# EAGLE design MM24I (EAGLE 9.5.2)

## Sheet 1 of 3
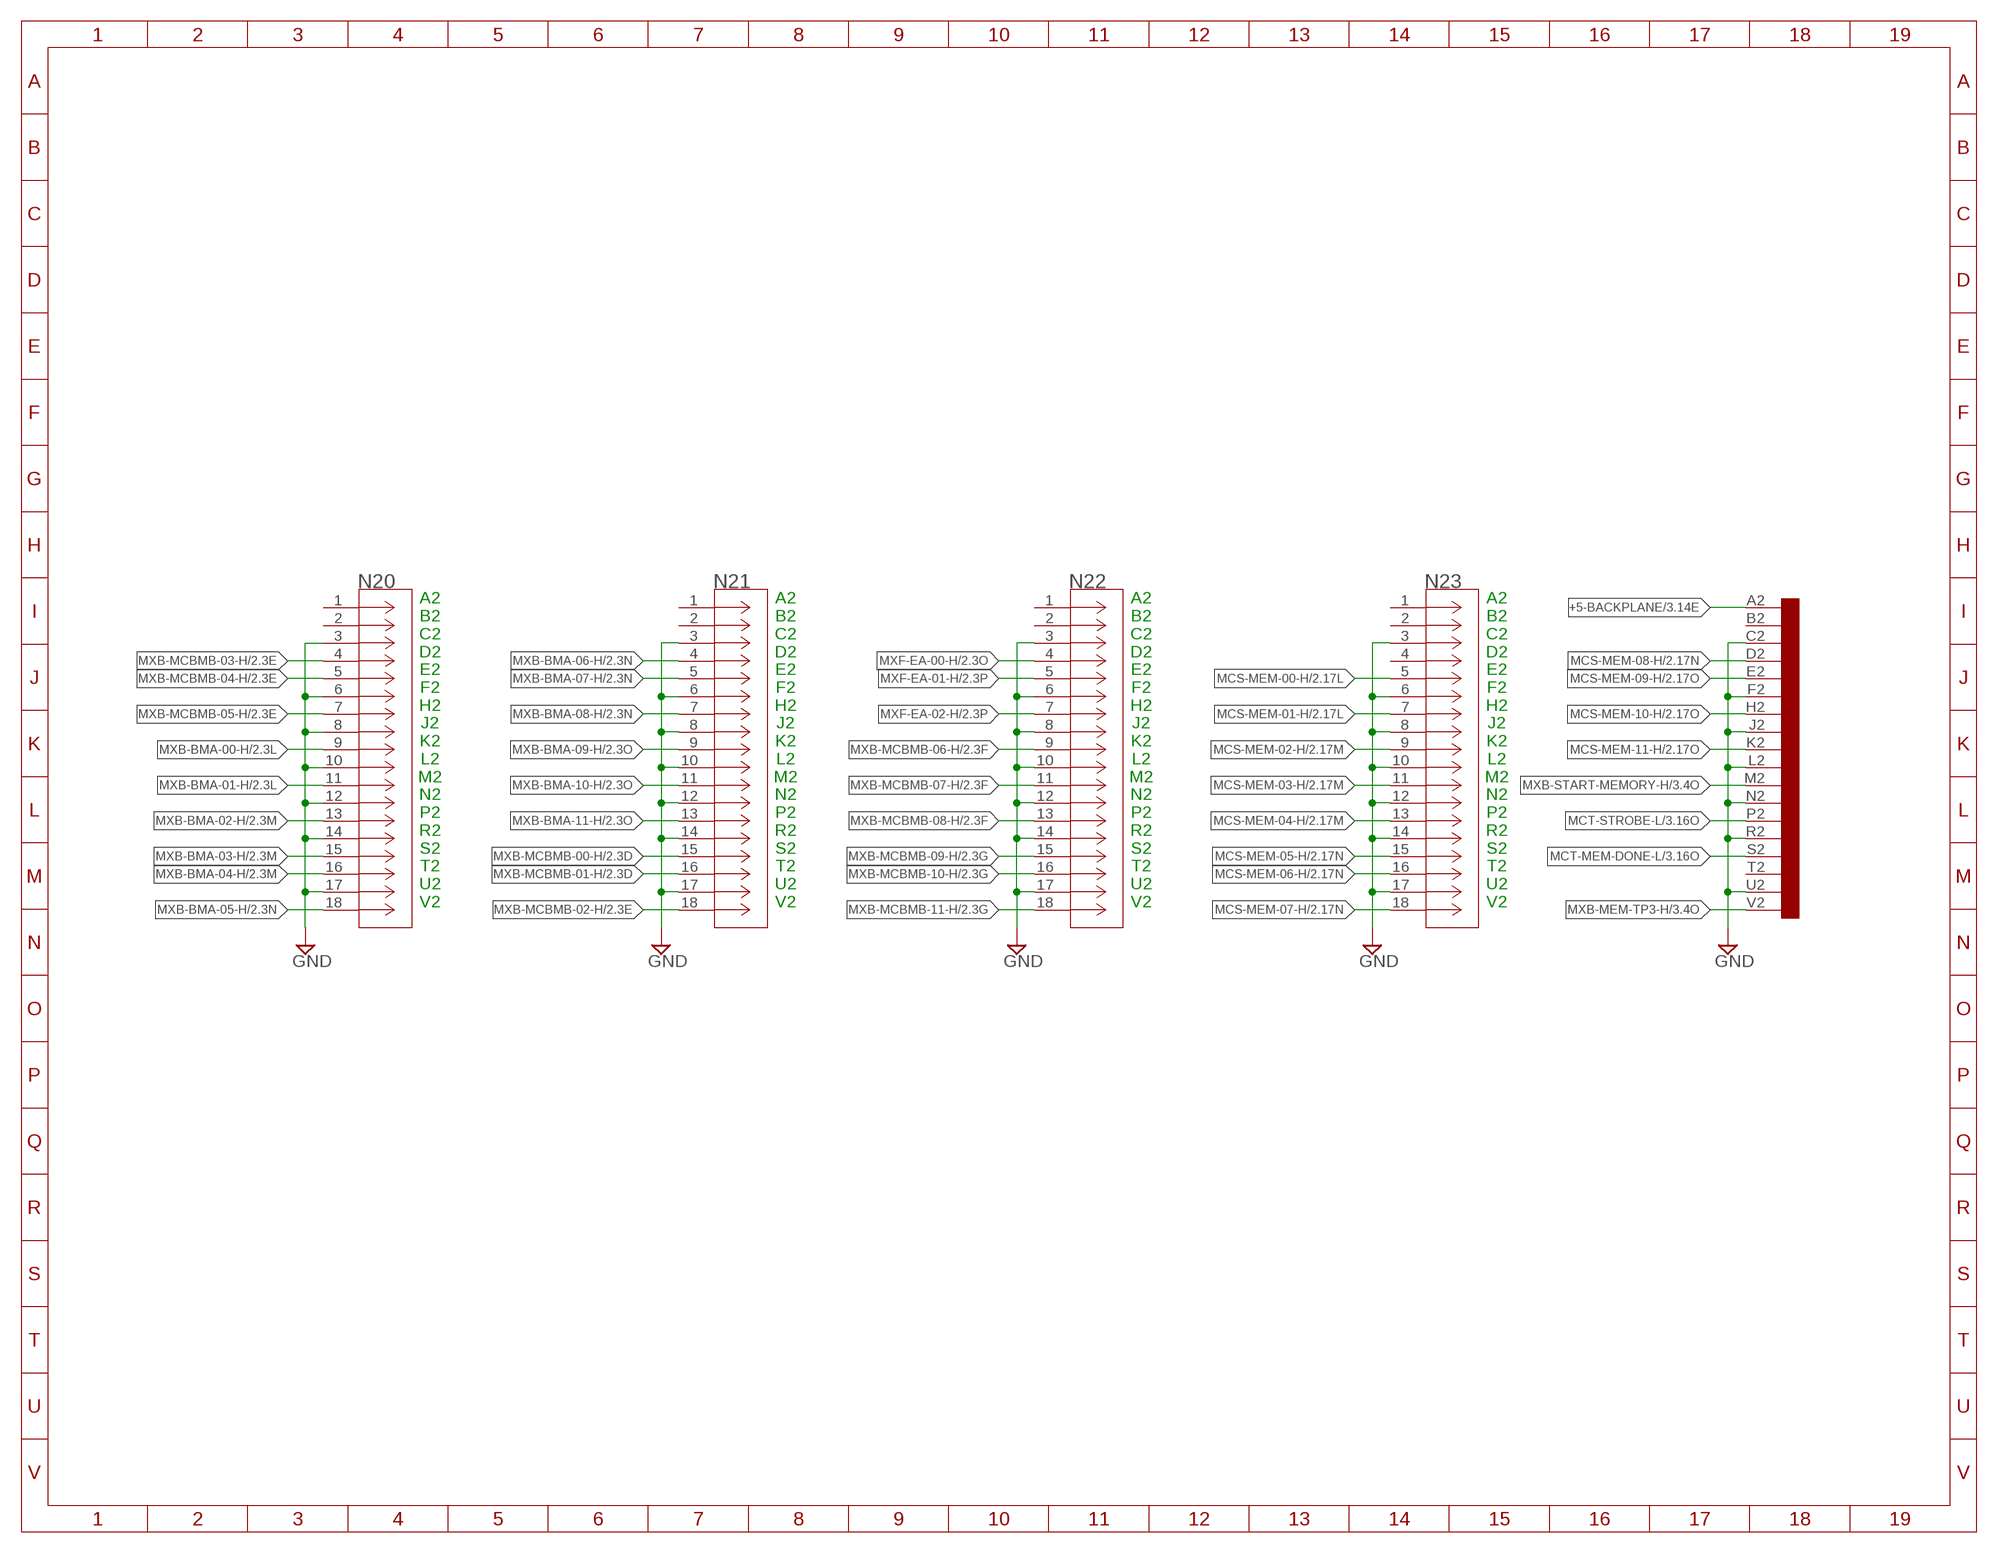
[diagram p0: schematic, sheet 1]

### Parts
N20  FH12-18S-0.5SV(55)  [CON18_1X18_DUTB_HRS]
N21  FH12-18S-0.5SV(55)  [CON18_1X18_DUTB_HRS]
N22  FH12-18S-0.5SV(55)  [CON18_1X18_DUTB_HRS]
N23  FH12-18S-0.5SV(55)  [CON18_1X18_DUTB_HRS]
U$1  SINGLE  [EDGE-CON2]

### Nets
+5-BACKPLANE [power]: U$1.A2 ; also sheet 3
GND [power]: N20.3 N20.6 N20.8 N20.10 N20.12 N20.14 N20.17 N21.3 N21.6 N21.8 N21.10 N21.12 N21.14 N21.17 N22.3 N22.6 N22.8 N22.10 N22.12 N22.14 N22.17 N23.3 N23.6 N23.8 N23.10 N23.12 N23.14 N23.17 U$1.C2 U$1.F2 U$1.J2 U$1.L2 U$1.N2 U$1.R2 U$1.U2 ; also sheet 2,3
MCS-MEM-00-H: N23.5 ; also sheet 2
MCS-MEM-01-H: N23.7 ; also sheet 2
MCS-MEM-02-H: N23.9 ; also sheet 2
MCS-MEM-03-H: N23.11 ; also sheet 2
MCS-MEM-04-H: N23.13 ; also sheet 2
MCS-MEM-05-H: N23.15 ; also sheet 2
MCS-MEM-06-H: N23.16 ; also sheet 2
MCS-MEM-07-H: N23.18 ; also sheet 2
MCS-MEM-08-H: U$1.D2 ; also sheet 2
MCS-MEM-09-H: U$1.E2 ; also sheet 2
MCS-MEM-10-H: U$1.H2 ; also sheet 2
MCS-MEM-11-H: U$1.K2 ; also sheet 2
MCT-MEM-DONE-L: U$1.S2 ; also sheet 3
MCT-STROBE-L: U$1.P2 ; also sheet 3
MXB-BMA-00-H: N20.9 ; also sheet 2
MXB-BMA-01-H: N20.11 ; also sheet 2
MXB-BMA-02-H: N20.13 ; also sheet 2
MXB-BMA-03-H: N20.15 ; also sheet 2
MXB-BMA-04-H: N20.16 ; also sheet 2
MXB-BMA-05-H: N20.18 ; also sheet 2
MXB-BMA-06-H: N21.4 ; also sheet 2
MXB-BMA-07-H: N21.5 ; also sheet 2
MXB-BMA-08-H: N21.7 ; also sheet 2
MXB-BMA-09-H: N21.9 ; also sheet 2
MXB-BMA-10-H: N21.11 ; also sheet 2
MXB-BMA-11-H: N21.13 ; also sheet 2
MXB-MCBMB-00-H: N21.15 ; also sheet 2
MXB-MCBMB-01-H: N21.16 ; also sheet 2
MXB-MCBMB-02-H: N21.18 ; also sheet 2
MXB-MCBMB-03-H: N20.4 ; also sheet 2
MXB-MCBMB-04-H: N20.5 ; also sheet 2
MXB-MCBMB-05-H: N20.7 ; also sheet 2
MXB-MCBMB-06-H: N22.9 ; also sheet 2
MXB-MCBMB-07-H: N22.11 ; also sheet 2
MXB-MCBMB-08-H: N22.13 ; also sheet 2
MXB-MCBMB-09-H: N22.15 ; also sheet 2
MXB-MCBMB-10-H: N22.16 ; also sheet 2
MXB-MCBMB-11-H: N22.18 ; also sheet 2
MXB-MEM-TP3-H: U$1.V2 ; also sheet 3
MXB-START-MEMORY-H: U$1.M2 ; also sheet 3
MXF-EA-00-H: N22.4 ; also sheet 2
MXF-EA-01-H: N22.5 ; also sheet 2
MXF-EA-02-H: N22.7 ; also sheet 2
Unconnected: N20.1 N20.2 N21.1 N21.2 N22.1 N22.2 N23.1 N23.2 N23.4 U$1.A1 U$1.B1 U$1.B2 U$1.C1 U$1.D1 U$1.E1 U$1.F1 U$1.H1 U$1.J1 U$1.K1 U$1.L1 U$1.M1 U$1.N1 U$1.P1 U$1.R1 U$1.S1 U$1.T1 U$1.T2 U$1.U1 U$1.V1

### Notes on the sheet
- A2
  B2
  C2
  D2
  E2
  F2
  H2
  J2
  K2
  L2
  M2
  N2
  P2
  R2
  S2
  T2
  U2
  V2
- A2
  B2
  C2
  D2
  E2
  F2
  H2
  J2
  K2
  L2
  M2
  N2
  P2
  R2
  S2
  T2
  U2
  V2
- A2
  B2
  C2
  D2
  E2
  F2
  H2
  J2
  K2
  L2
  M2
  N2
  P2
  R2
  S2
  T2
  U2
  V2
- A2
  B2
  C2
  D2
  E2
  F2
  H2
  J2
  K2
  L2
  M2
  N2
  P2
  R2
  S2
  T2
  U2
  V2

## Sheet 2 of 3
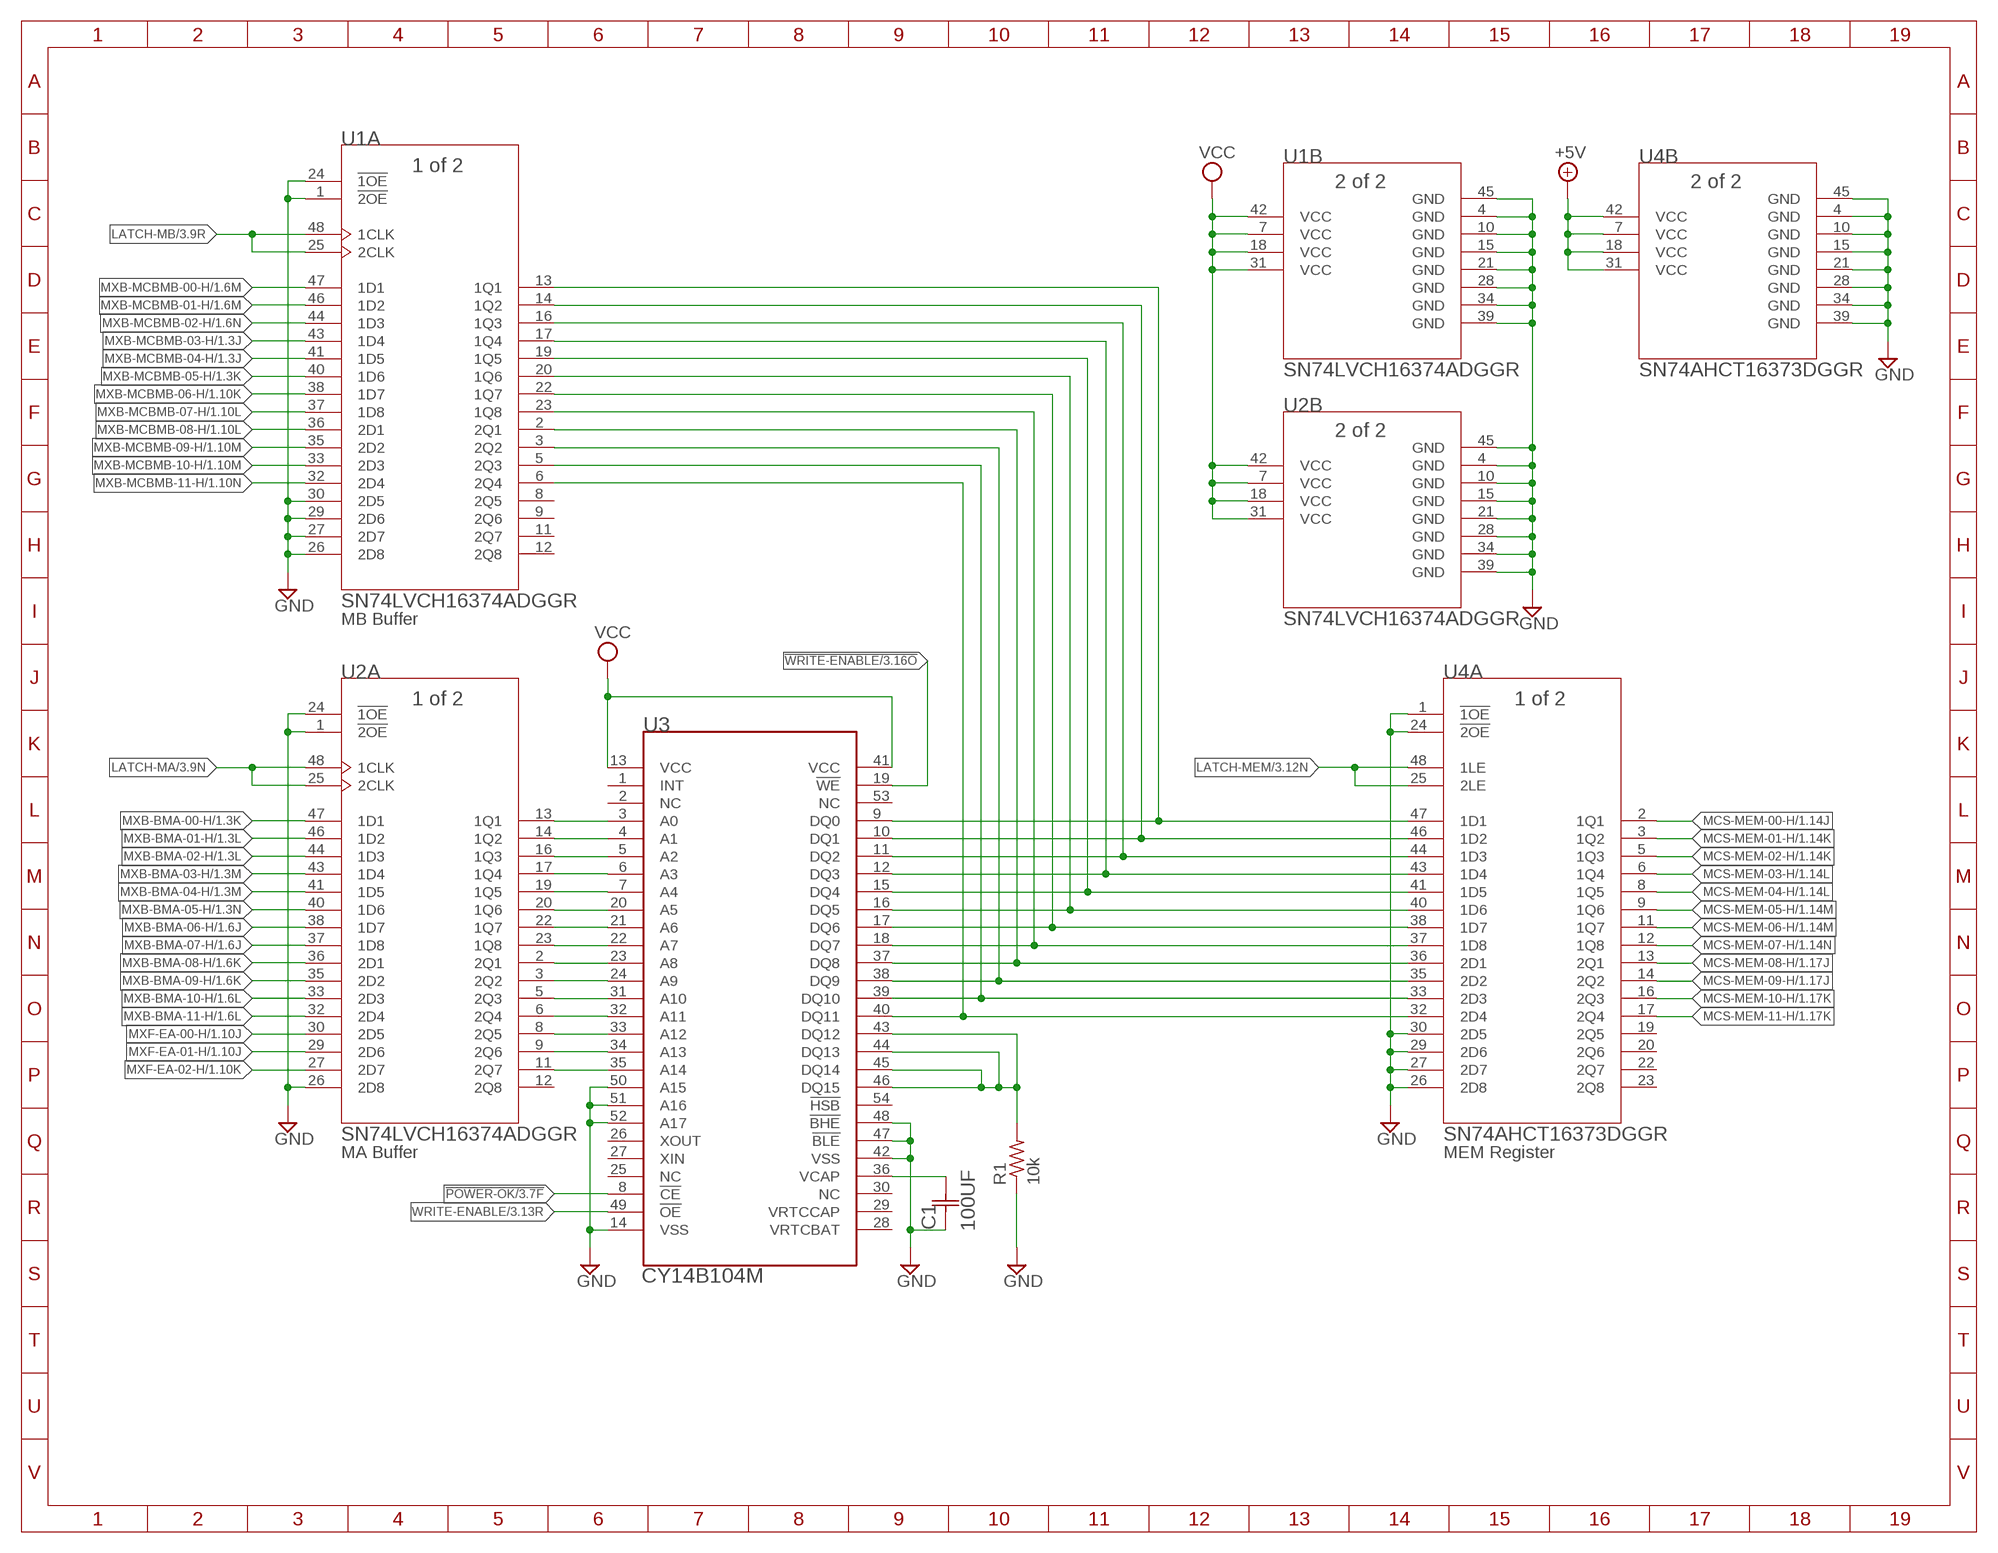
[diagram p1: schematic, sheet 2]

### Parts
C1  100UF  NOJD107M010RWJ  [CAPCP7343X430N]
R1  10k  R-US_R0402  [R0402]
U1  SN74LVCH16374ADGGR  [DGG48]
U2  SN74LVCH16374ADGGR  [DGG48]
U3  CY14B104M  [TSOPII-54]
U4  SN74AHCT16373DGGR  [DGG48]

### Nets
!POWER-OK: U3.8(!CE) ; also sheet 3
!WRITE-ENABLE: U3.19(!WE) ; also sheet 3
+5V [power]: U4.7(B:VCC) U4.18(B:VCC) U4.31(B:VCC) U4.42(B:VCC) ; also sheet 3
GND [power]: C1.2(C2) R1.1 U1.1(A:!2OE) U1.4(B:GND) U1.10(B:GND) U1.15(B:GND) U1.21(B:GND) U1.24(A:!1OE) U1.26(A:2D8) U1.27(A:2D7) U1.28(B:GND) U1.29(A:2D6) U1.30(A:2D5) U1.34(B:GND) U1.39(B:GND) U1.45(B:GND) U2.1(A:!2OE) U2.4(B:GND) U2.10(B:GND) U2.15(B:GND) U2.21(B:GND) U2.24(A:!1OE) U2.26(A:2D8) U2.28(B:GND) U2.34(B:GND) U2.39(B:GND) U2.45(B:GND) U3.14(VSS) U3.42(VSS) U3.47(!BLE) U3.48(!BHE) U3.50(A15) U3.51(A16) U3.52(A17) U4.1(A:!1OE) U4.4(B:GND) U4.10(B:GND) U4.15(B:GND) U4.21(B:GND) U4.24(A:!2OE) U4.26(A:2D8) U4.27(A:2D7) U4.28(B:GND) U4.29(A:2D6) U4.30(A:2D5) U4.34(B:GND) U4.39(B:GND) U4.45(B:GND) ; also sheet 1,3
LATCH-MA: U2.25(A:2CLK) U2.48(A:1CLK) ; also sheet 3
LATCH-MB: U1.25(A:2CLK) U1.48(A:1CLK) ; also sheet 3
LATCH-MEM: U4.25(A:2LE) U4.48(A:1LE) ; also sheet 3
MCS-MEM-00-H: U4.2(A:1Q1) ; also sheet 1
MCS-MEM-01-H: U4.3(A:1Q2) ; also sheet 1
MCS-MEM-02-H: U4.5(A:1Q3) ; also sheet 1
MCS-MEM-03-H: U4.6(A:1Q4) ; also sheet 1
MCS-MEM-04-H: U4.8(A:1Q5) ; also sheet 1
MCS-MEM-05-H: U4.9(A:1Q6) ; also sheet 1
MCS-MEM-06-H: U4.11(A:1Q7) ; also sheet 1
MCS-MEM-07-H: U4.12(A:1Q8) ; also sheet 1
MCS-MEM-08-H: U4.13(A:2Q1) ; also sheet 1
MCS-MEM-09-H: U4.14(A:2Q2) ; also sheet 1
MCS-MEM-10-H: U4.16(A:2Q3) ; also sheet 1
MCS-MEM-11-H: U4.17(A:2Q4) ; also sheet 1
MXB-BMA-00-H: U2.47(A:1D1) ; also sheet 1
MXB-BMA-01-H: U2.46(A:1D2) ; also sheet 1
MXB-BMA-02-H: U2.44(A:1D3) ; also sheet 1
MXB-BMA-03-H: U2.43(A:1D4) ; also sheet 1
MXB-BMA-04-H: U2.41(A:1D5) ; also sheet 1
MXB-BMA-05-H: U2.40(A:1D6) ; also sheet 1
MXB-BMA-06-H: U2.38(A:1D7) ; also sheet 1
MXB-BMA-07-H: U2.37(A:1D8) ; also sheet 1
MXB-BMA-08-H: U2.36(A:2D1) ; also sheet 1
MXB-BMA-09-H: U2.35(A:2D2) ; also sheet 1
MXB-BMA-10-H: U2.33(A:2D3) ; also sheet 1
MXB-BMA-11-H: U2.32(A:2D4) ; also sheet 1
MXB-MCBMB-00-H: U1.47(A:1D1) ; also sheet 1
MXB-MCBMB-01-H: U1.46(A:1D2) ; also sheet 1
MXB-MCBMB-02-H: U1.44(A:1D3) ; also sheet 1
MXB-MCBMB-03-H: U1.43(A:1D4) ; also sheet 1
MXB-MCBMB-04-H: U1.41(A:1D5) ; also sheet 1
MXB-MCBMB-05-H: U1.40(A:1D6) ; also sheet 1
MXB-MCBMB-06-H: U1.38(A:1D7) ; also sheet 1
MXB-MCBMB-07-H: U1.37(A:1D8) ; also sheet 1
MXB-MCBMB-08-H: U1.36(A:2D1) ; also sheet 1
MXB-MCBMB-09-H: U1.35(A:2D2) ; also sheet 1
MXB-MCBMB-10-H: U1.33(A:2D3) ; also sheet 1
MXB-MCBMB-11-H: U1.32(A:2D4) ; also sheet 1
MXF-EA-00-H: U2.30(A:2D5) ; also sheet 1
MXF-EA-01-H: U2.29(A:2D6) ; also sheet 1
MXF-EA-02-H: U2.27(A:2D7) ; also sheet 1
N$2: U1.13(A:1Q1) U3.9(DQ0) U4.47(A:1D1)
N$3: U1.14(A:1Q2) U3.10(DQ1) U4.46(A:1D2)
N$4: U1.16(A:1Q3) U3.11(DQ2) U4.44(A:1D3)
N$5: U1.17(A:1Q4) U3.12(DQ3) U4.43(A:1D4)
N$6: U1.19(A:1Q5) U3.15(DQ4) U4.41(A:1D5)
N$7: U1.20(A:1Q6) U3.16(DQ5) U4.40(A:1D6)
N$9: R1.2 U3.43(DQ12) U3.44(DQ13) U3.45(DQ14) U3.46(DQ15)
N$11: U1.22(A:1Q7) U3.17(DQ6) U4.38(A:1D7)
N$13: U1.23(A:1Q8) U3.18(DQ7) U4.37(A:1D8)
N$14: U1.2(A:2Q1) U3.37(DQ8) U4.36(A:2D1)
N$15: U1.3(A:2Q2) U3.38(DQ9) U4.35(A:2D2)
N$16: U1.5(A:2Q3) U3.39(DQ10) U4.33(A:2D3)
N$17: U1.6(A:2Q4) U3.40(DQ11) U4.32(A:2D4)
N$30: U2.2(A:2Q1) U3.23(A8)
N$31: U2.16(A:1Q3) U3.5(A2)
N$32: U2.13(A:1Q1) U3.3(A0)
N$33: U2.14(A:1Q2) U3.4(A1)
N$34: U2.17(A:1Q4) U3.6(A3)
N$36: U2.19(A:1Q5) U3.7(A4)
N$37: U2.20(A:1Q6) U3.20(A5)
N$38: U2.22(A:1Q7) U3.21(A6)
N$39: U2.23(A:1Q8) U3.22(A7)
N$40: U2.3(A:2Q2) U3.24(A9)
N$41: U2.5(A:2Q3) U3.31(A10)
N$42: U2.6(A:2Q4) U3.32(A11)
N$43: U2.8(A:2Q5) U3.33(A12)
N$44: U2.9(A:2Q6) U3.34(A13)
N$45: U2.11(A:2Q7) U3.35(A14)
VCAP [power]: C1.1(C1) U3.36(VCAP)
VCC [power]: U1.7(B:VCC) U1.18(B:VCC) U1.31(B:VCC) U1.42(B:VCC) U2.7(B:VCC) U2.18(B:VCC) U2.31(B:VCC) U2.42(B:VCC) U3.13(VCC) U3.41(VCC) ; also sheet 3
WRITE-ENABLE: U3.49(!OE) ; also sheet 3
Unconnected: U1.8(A:2Q5) U1.9(A:2Q6) U1.11(A:2Q7) U1.12(A:2Q8) U2.12(A:2Q8) U3.1(INT) U3.2(NC) U3.25(NC) U3.26(XOUT) U3.27(XIN) U3.28(VRTCBAT) U3.29(VRTCCAP) U3.30(NC) U3.53(NC) U3.54(!HSB) U4.19(A:2Q5) U4.20(A:2Q6) U4.22(A:2Q7) U4.23(A:2Q8)

### Notes on the sheet
- MB Buffer
- MA Buffer | MEM Register

## Sheet 3 of 3
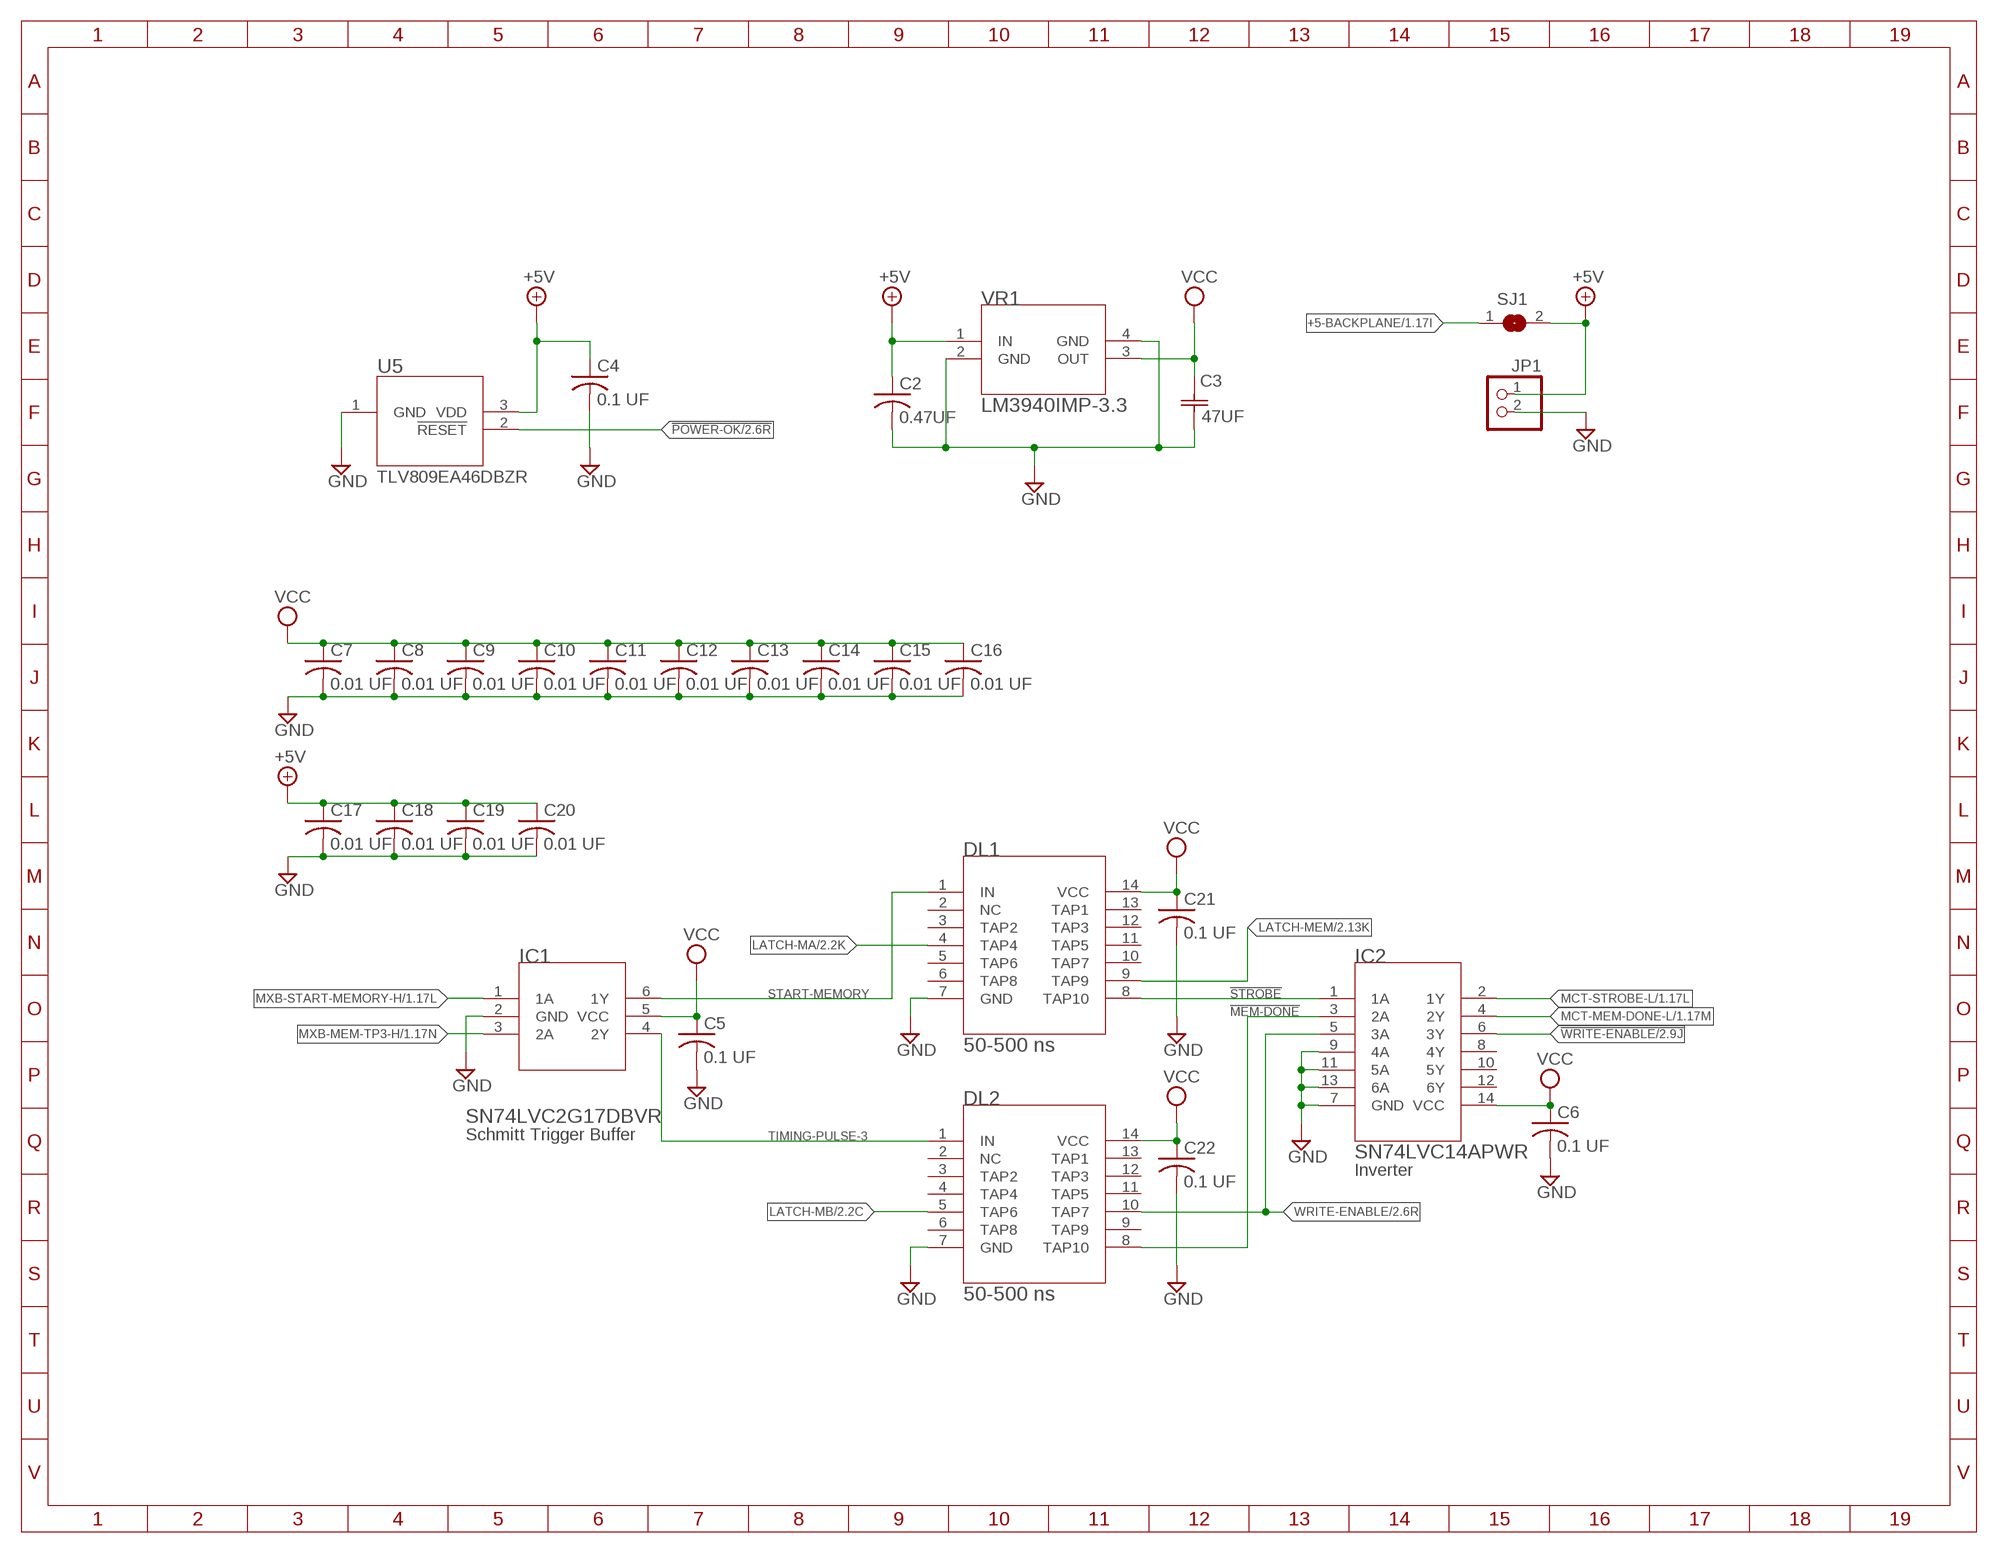
[diagram p2: schematic, sheet 3]

### Parts
C2  0.47UF  C-USC0805  [C0805]
C3  47UF  NOJC476M010RWJ  [NOJC]
C4  0.1 UF  C-USC0402  [C0402]
C5  0.1 UF  C-USC0402  [C0402]
C6  0.1 UF  C-USC0402  [C0402]
C7  0.01 UF  C-USC0402  [C0402]
C8  0.01 UF  C-USC0402  [C0402]
C9  0.01 UF  C-USC0402  [C0402]
C10  0.01 UF  C-USC0402  [C0402]
C11  0.01 UF  C-USC0402  [C0402]
C12  0.01 UF  C-USC0402  [C0402]
C13  0.01 UF  C-USC0402  [C0402]
C14  0.01 UF  C-USC0402  [C0402]
C15  0.01 UF  C-USC0402  [C0402]
C16  0.01 UF  C-USC0402  [C0402]
C17  0.01 UF  C-USC0402  [C0402]
C18  0.01 UF  C-USC0402  [C0402]
C19  0.01 UF  C-USC0402  [C0402]
C20  0.01 UF  C-USC0402  [C0402]
C21  0.1 UF  C-USC0402  [C0402]
C22  0.1 UF  C-USC0402  [C0402]
DL1  50-500 ns  DS1110LE-500+  [21-0066J_14]
DL2  50-500 ns  DS1110LE-500+  [21-0066J_14]
IC1  SN74LVC2G17DBVR  [DBV6]
IC2  SN74LVC14APWR  [PW14]
JP1  PINHD-1X2  [1X02]
SJ1  SJ  [SJ]
U5  TLV809EA46DBZR  [DBZ3]
VR1  LM3940IMP-3.3  [MP04A]

### Nets
!MEM-DONE: DL2.8(TAP10) IC2.3(2A)
!POWER-OK: U5.2(!RESET) ; also sheet 2
!STROBE: DL1.8(TAP10) IC2.1(1A)
!WRITE-ENABLE: IC2.6(3Y) ; also sheet 2
+5-BACKPLANE [power]: SJ1.1 ; also sheet 1
+5V [power]: C2.1 C4.1 C17.1 C18.1 C19.1 C20.1 JP1.1 SJ1.2 U5.3(VDD) VR1.1(IN) ; also sheet 2
GND [power]: C2.2 C3.2(C2) C4.2 C5.2 C6.2 C7.2 C8.2 C9.2 C10.2 C11.2 C12.2 C13.2 C14.2 C15.2 C16.2 C17.2 C18.2 C19.2 C20.2 C21.2 C22.2 DL1.7(GND) DL2.7(GND) IC1.2(GND) IC2.7(GND) IC2.9(4A) IC2.11(5A) IC2.13(6A) JP1.2 U5.1(GND) VR1.2(GND) VR1.4(GND) ; also sheet 1,2
LATCH-MA: DL1.4(TAP4) ; also sheet 2
LATCH-MB: DL2.5(TAP6) ; also sheet 2
LATCH-MEM: DL1.9(TAP9) ; also sheet 2
MCT-MEM-DONE-L: IC2.4(2Y) ; also sheet 1
MCT-STROBE-L: IC2.2(1Y) ; also sheet 1
MXB-MEM-TP3-H: IC1.3(2A) ; also sheet 1
MXB-START-MEMORY-H: IC1.1(1A) ; also sheet 1
START-MEMORY: DL1.1(IN) IC1.6(1Y)
TIMING-PULSE-3: DL2.1(IN) IC1.4(2Y)
VCC [power]: C3.1(C1) C5.1 C6.1 C7.1 C8.1 C9.1 C10.1 C11.1 C12.1 C13.1 C14.1 C15.1 C16.1 C21.1 C22.1 DL1.14(VCC) DL2.14(VCC) IC1.5(VCC) IC2.14(VCC) VR1.3(OUT) ; also sheet 2
WRITE-ENABLE: DL2.10(TAP7) IC2.5(3A) ; also sheet 2
Unconnected: DL1.2(NC) DL1.3(TAP2) DL1.5(TAP6) DL1.6(TAP8) DL1.10(TAP7) DL1.11(TAP5) DL1.12(TAP3) DL1.13(TAP1) DL2.2(NC) DL2.3(TAP2) DL2.4(TAP4) DL2.6(TAP8) DL2.9(TAP9) DL2.11(TAP5) DL2.12(TAP3) DL2.13(TAP1) IC2.8(4Y) IC2.10(5Y) IC2.12(6Y)

### Notes on the sheet
- Schmitt Trigger Buffer
- Inverter

## Library data of the parts
C1 = MM24I:NOJD107M010RWJ: CAP NIOB OXIDE , 2917; CAPACITANCETOLERANCE: ±20%; MPN: NOJD107M010RWJ; SUPPLIER: AVX; VOLTAGERATING: 10V
C2 C4-C22 = rcl:C-US: CAPACITOR, American symbol; SPICEPREFIX: C
C3 = MM24I:NOJC476M010RWJ: CAP, NIOB OXIDE, 2312; BUILT_BY: EMA_UL_Team; MANUFACTURER_PART_NUMBER: NOJC476M010RWJ; VENDOR: AVX Corporation
DL1 DL2 = MM24I:DS1110LE-500+; BUILT_BY: EMA_UL_Team; MANUFACTURER_PART_NUMBER: DS1110LE-100+; VENDOR: Maxim Integrated Products
IC1 = MM24I:SN74LVC2G17DBVR; BUILT_BY: EMA_UL_Team; MANUFACTURER: Texas Instruments; MANUFACTURER_PART_NUMBER: SN74LVC2G17DBVR; VENDOR: Texas Instruments
IC2 = MM24I:SN74LVC14APWR; BUILT_BY: EMA_UL_Team; MANUFACTURER: Texas Instruments; MANUFACTURER_PART_NUMBER: SN74LVC14APWR; VENDOR: Texas Instruments
JP1 = pinhead:PINHD-1X2: PIN HEADER
N20-N23 = MM24I:FH12-18S-0.5SV(55); BUILT_BY: EMA_UL_Team; MANUFACTURER_PART_NUMBER: FH12-18S-0.5SV(55); VENDOR: Hirose
R1 = rcl:R-US_: RESISTOR, American symbol; SPICEPREFIX: R
SJ1 = jumper:SJ: SMD solder JUMPER
U1 U2 = MM24I:SN74LVCH16374ADGGR; BUILT_BY: EMA_UL_Team; MANUFACTURER_PART_NUMBER: SN74LVCH16374ADGGR; VENDOR: Texas Instruments
U3 = MM24I:CY14B104M: Cypress CY14B104M 4-Mbit (256 K × 16) nvSRAM with Real Time Clock https://www.cypress.com/file/43036/download
U4 = MM24I:SN74AHCT16373DGGR; BUILT_BY: EMA_UL_Team; MANUFACTURER: Texas Instruments; MANUFACTURER_PART_NUMBER: SN74AHCT16373DGGR; VENDOR: Texas Instruments
U5 = MM24I:TLV809EA46DBZR; DELAY: 200ms; MANUFACTURER: Texas Instruments; MANUFACTURER_PART_NUMBER: TLV809EA46DBZR; THRESHOLD: 4.6V; VENDOR: Texas Instruments
U$1 = dec-con:SINGLE: Single-Height DEC board
VR1 = MM24I:LM3940IMP-3.3; BUILT_BY: EMA_UL_Team; MANUFACTURER_PART_NUMBER: LM3940IMP-3.3/NOPB; VENDOR: Texas Instruments

## Net classes
0 default: width 0.15 mm, drill 0.2 mm
1 power: width 0.3 mm, drill 0.3 mm

## Board
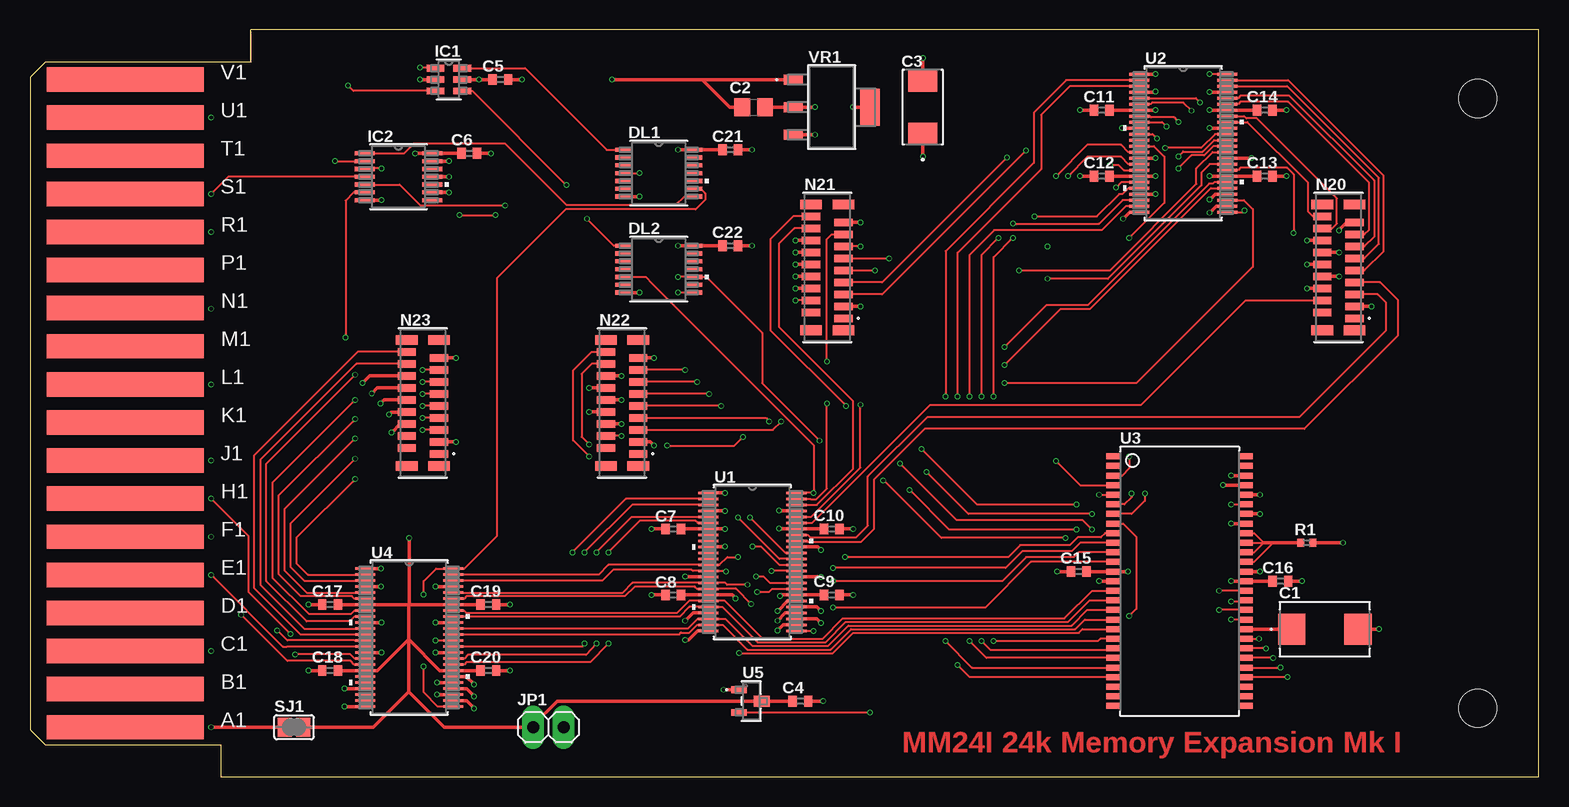
[diagram p3: board, top side]
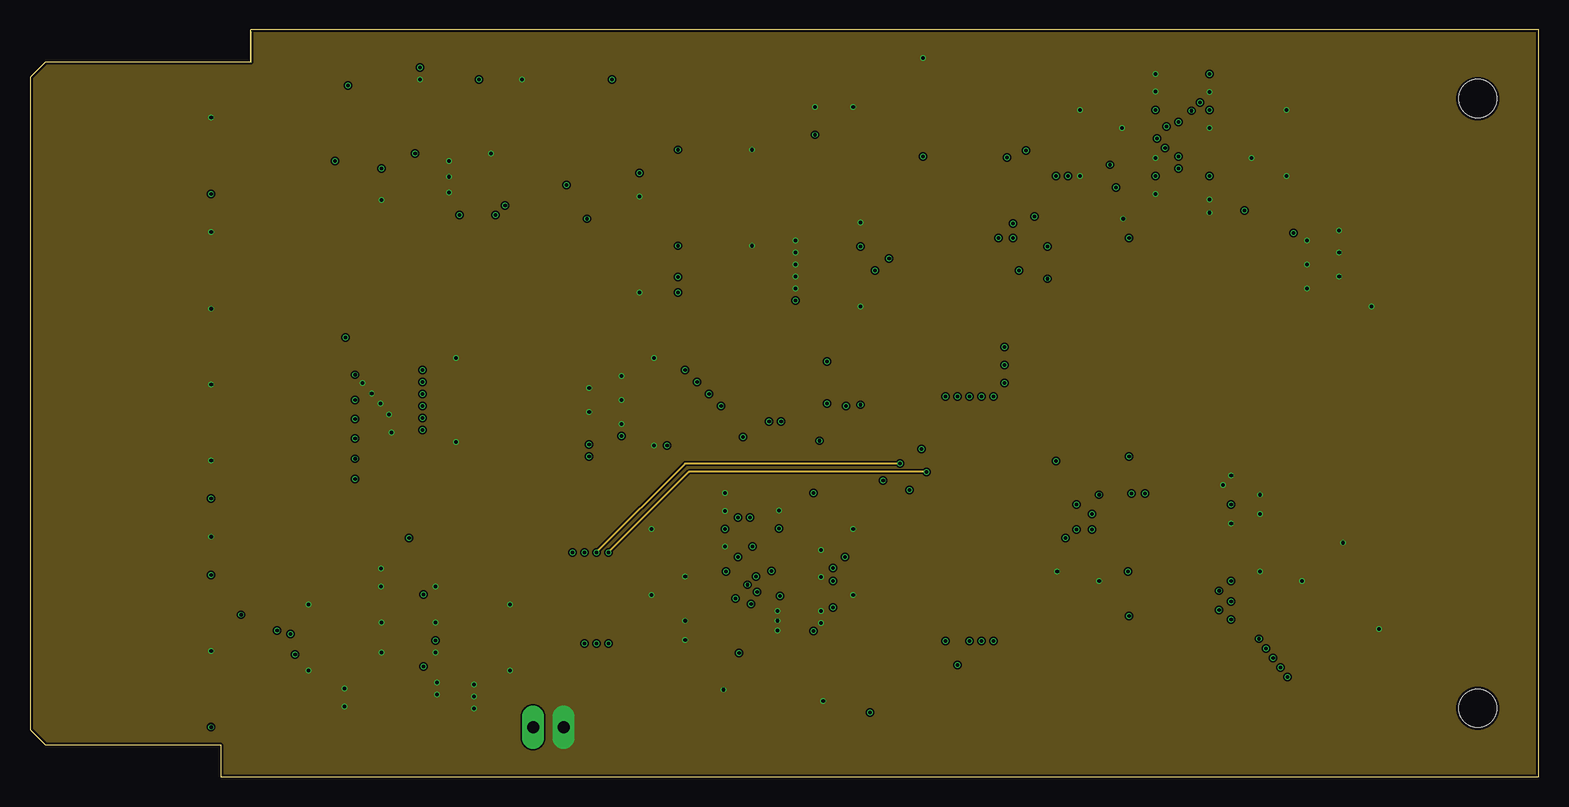
[diagram p4: board, inner layer Layer2]
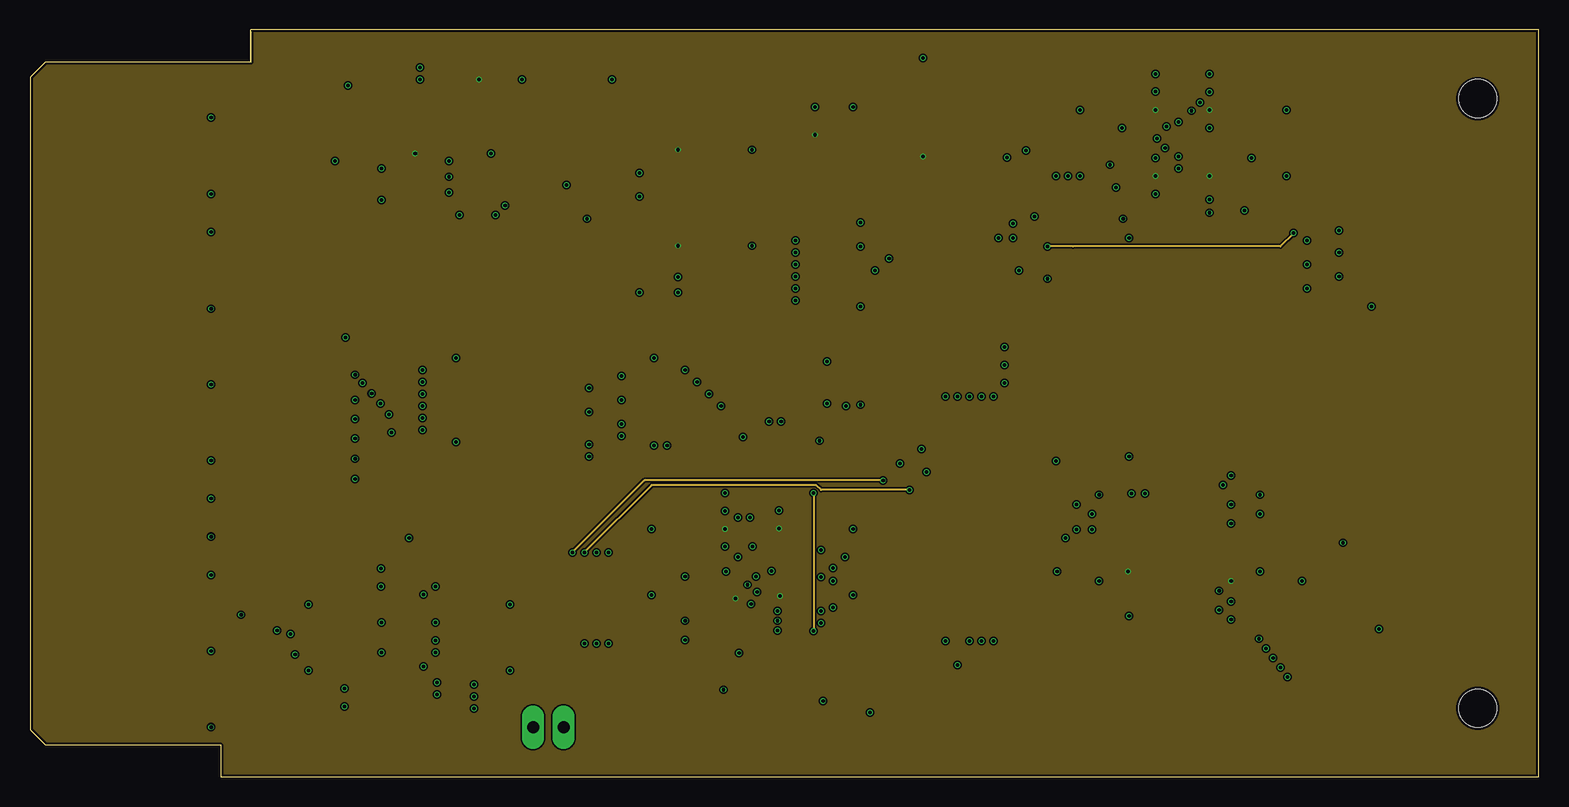
[diagram p5: board, inner layer Layer3]
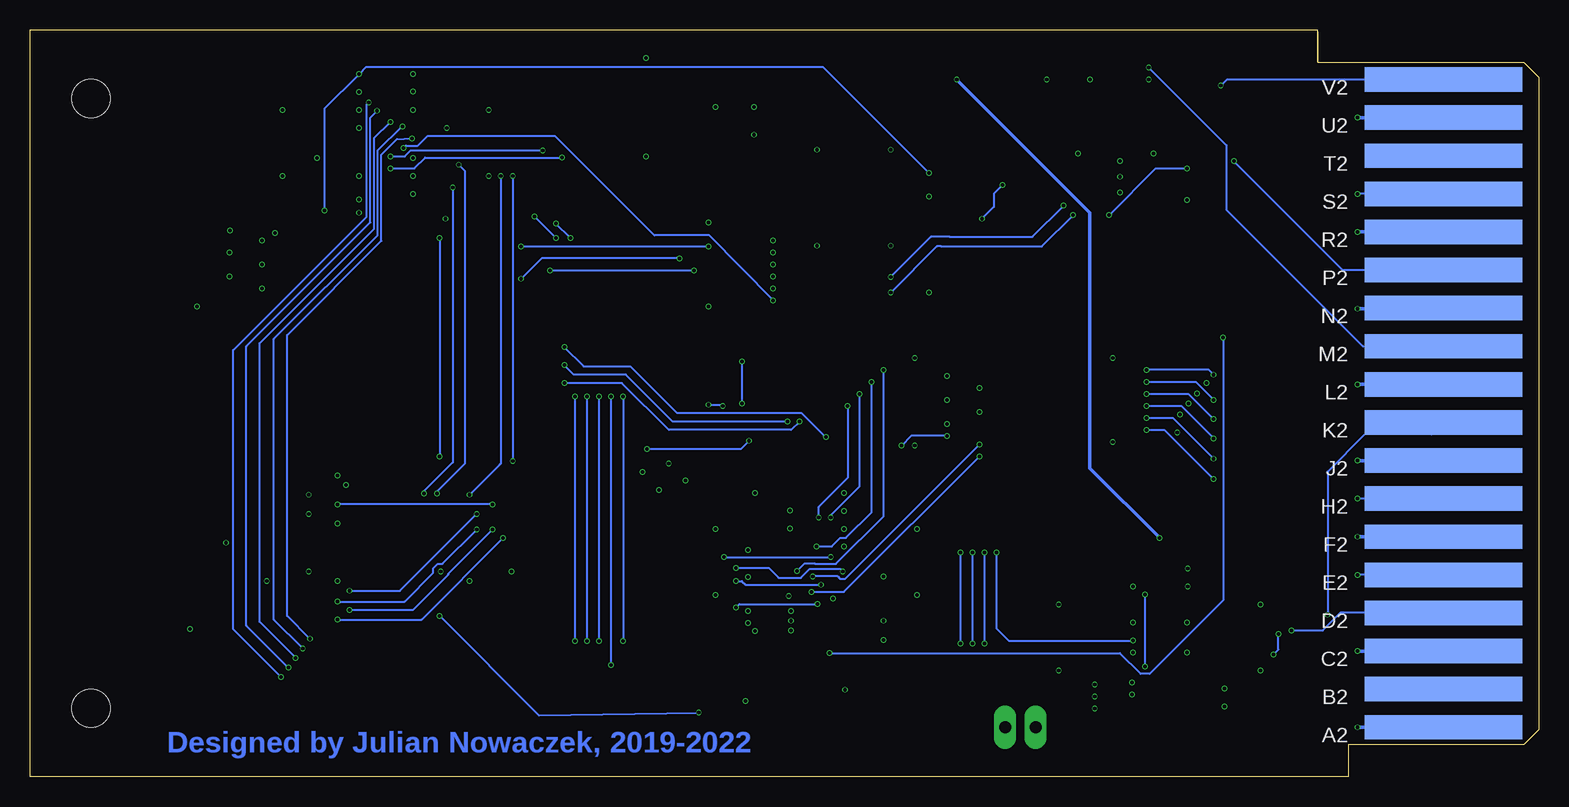
[diagram p6: board, bottom side, seen from below]

Size 125.73 x 62.23 mm. Coordinates in mm from the lower left corner, seen from the top.
Copper layers (1+2*15+16): Top 0.035mm / dielectric 0.11mm / Layer2 0.035mm / dielectric 0.8mm / Layer3 0.035mm / dielectric 0.11mm / Bottom 0.035mm
Design rules "jlcpcb-2layers *": minimum track width 5mil, minimum drill 0.3mm, track to track 5mil, track to pad 5mil, pad to pad 5mil, via to via 5mil, smd to smd 5mil, copper to edge 0.2mm, drill to drill 6mil, minimum pad ring 10mil, minimum via ring 3mil, stop-mask expansion 4mil, vias tented up to drill 0mil, thermal gap 0mil

### Footprints (pad centres in the part's own frame; a part is rotated, then mirrored left to right if it is on the bottom)
CAPCP7343X430N = smd 2.261 x 2.591: 1 -2.769,0; 2 2.769,0
C0805 = smd 1.3 x 1.5: 1 -0.95,0; 2 0.95,0
NOJC = smd 1.88 x 2.413: 1 -2.235,0; 2 2.235,0
C0402 = smd 0.7 x 0.9: 1 -0.65,0; 2 0.65,0
21-0066J_14 = smd 1.422 x 0.356: 1 -2.921,1.95; 2 -2.921,1.3; 3 -2.921,0.65; 4 -2.921,0; 5 -2.921,-0.65; 6 -2.921,-1.3; 7 -2.921,-1.95; 8 2.921,-1.95; 9 2.921,-1.3; 10 2.921,-0.65; 11 2.921,0; 12 2.921,0.65; 13 2.921,1.3; 14 2.921,1.95
DBV6 = smd 1.473 x 0.559: 1 -1.118,0.95; 2 -1.118,0; 3 -1.118,-0.95; 4 1.118,-0.95; 5 1.118,0; 6 1.118,0.95
PW14 = smd 1.676 x 0.356: 1 -2.819,1.95; 2 -2.819,1.3; 3 -2.819,0.65; 4 -2.819,0; 5 -2.819,-0.65; 6 -2.819,-1.3; 7 -2.819,-1.95; 8 2.819,-1.95; 9 2.819,-1.3; 10 2.819,-0.65; 11 2.819,0; 12 2.819,0.65; 13 2.819,1.3; 14 2.819,1.95
1X02 = drill 1.016 long: 1 -1.27,0; 2 1.27,0
CON18_1X18_DUTB_HRS = smd 0.61 x 1.524: 1 0,5.385; 2 -0.5,2.692; 3 -1,5.385; 4 -1.5,2.692; 5 -2,5.385; 6 -2.5,2.692; 7 -3,5.385; 8 -3.5,2.692; 9 -4,5.385; 10 -4.5,2.692; 11 -5,5.385; 12 -5.5,2.692; 13 -6,5.385; 14 -6.5,2.692; 15 -7,5.385; 16 -7.5,2.692; 17 -8,5.385; 18 -8.5,2.692 | smd 0.813 x 1.803: 19 -9.495,2.692; 20 0.995,2.692; 21 -9.495,5.385; 22 0.995,5.385
R0402 = smd 0.6 x 0.7: 1 -0.5,0; 2 0.5,0
SJ = smd 1.168 x 1.6: 1 -0.762,0; 2 0.762,0
DGG48 = smd 1.676 x 0.229: 1 -3.67,5.75; 2 -3.67,5.25; 3 -3.67,4.75; 4 -3.67,4.25; 5 -3.67,3.75; 6 -3.67,3.25; 7 -3.67,2.75; 8 -3.67,2.25; 9 -3.67,1.75; 10 -3.67,1.25; 11 -3.67,0.75; 12 -3.67,0.25; 13 -3.67,-0.25; 14 -3.67,-0.75; 15 -3.67,-1.25; 16 -3.67,-1.75; 17 -3.67,-2.25; 18 -3.67,-2.75; 19 -3.67,-3.25; 20 -3.67,-3.75; 21 -3.67,-4.25; 22 -3.67,-4.75; 23 -3.67,-5.25; 24 -3.67,-5.75; 25 3.67,-5.75; 26 3.67,-5.25; 27 3.67,-4.75; 28 3.67,-4.25; 29 3.67,-3.75; 30 3.67,-3.25; 31 3.67,-2.75; 32 3.67,-2.25; 33 3.67,-1.75; 34 3.67,-1.25; 35 3.67,-0.75; 36 3.67,-0.25; 37 3.67,0.25; 38 3.67,0.75; 39 3.67,1.25; 40 3.67,1.75; 41 3.67,2.25; 42 3.67,2.75; 43 3.67,3.25; 44 3.67,3.75; 45 3.67,4.25; 46 3.67,4.75; 47 3.67,5.25; 48 3.67,5.75
TSOPII-54 = smd 0.5 x 1.2: 1 -10.4,-5.502; 2 -9.6,-5.502; 3 -8.8,-5.502; 4 -8,-5.502; 5 -7.2,-5.502; 6 -6.4,-5.502; 7 -5.6,-5.502; 8 -4.8,-5.502; 9 -4,-5.502; 10 -3.2,-5.502; 11 -2.4,-5.502; 12 -1.6,-5.502; 13 -0.8,-5.502; 14 0,-5.502; 15 0.8,-5.502; 16 1.6,-5.502; 17 2.4,-5.502; 18 3.2,-5.502; 19 4,-5.502; 20 4.8,-5.502; 21 5.6,-5.502; 22 6.4,-5.502; 23 7.2,-5.502; 24 8,-5.502; 25 8.8,-5.502; 26 9.6,-5.502; 27 10.4,-5.502; 28 10.4,5.502; 29 9.6,5.502; 30 8.8,5.502; 31 8,5.502; 32 7.2,5.502; 33 6.4,5.502; 34 5.6,5.502; 35 4.8,5.502; 36 4,5.502; 37 3.2,5.502; 38 2.4,5.502; 39 1.6,5.502; 40 0.8,5.502; 41 0,5.502; 42 -0.8,5.502; 43 -1.6,5.502; 44 -2.4,5.502; 45 -3.2,5.502; 46 -4,5.502; 47 -4.8,5.502; 48 -5.6,5.502; 49 -6.4,5.502; 50 -7.2,5.502; 51 -8,5.502; 52 -8.8,5.502; 53 -9.6,5.502; 54 -10.4,5.502
DBZ3 = smd 0.559 x 1.321: 1 -0.95,-1.016; 2 0.95,-1.016 | smd 0.94 x 1.321: 3 0,0.883
EDGE-CON2 = smd 13.106 x 2.032: A1 7.938,4.128; B1 7.938,7.303; C1 7.938,10.477; D1 7.938,13.652; E1 7.938,16.828; F1 7.938,20.003; H1 7.938,23.177; J1 7.938,26.352; K1 7.938,29.527; L1 7.938,32.703; M1 7.938,35.877; N1 7.938,39.053; P1 7.938,42.227; R1 7.938,45.403; S1 7.938,48.578; T1 7.938,51.752; U1 7.938,54.928; V1 7.938,58.102 | smd 13.106 x 2.032 bottom: A2 7.938,4.128; B2 7.938,7.303; C2 7.938,10.477; D2 7.938,13.652; E2 7.938,16.828; F2 7.938,20.003; H2 7.938,23.177; J2 7.938,26.352; K2 7.938,29.527; L2 7.938,32.703; M2 7.938,35.877; N2 7.938,39.053; P2 7.938,42.227; R2 7.938,45.403; S2 7.938,48.578; T2 7.938,51.752; U2 7.938,54.928; V2 7.938,58.102
SINGLE = hole 3.175: 120.65,56.515; 120.65,5.715
MP04A = smd 1.6 x 0.838: 1 -3.2,2.3; 2 -3.2,0; 3 -3.2,-2.3 | smd 1.6 x 3.099: 4 3.2,0

### Placement (x,y rotation side)
C1  107.9,12.3 0 top
C2  60.3,55.8 0 top
C3  74.4,55.8 90 top
C4  64.2,6.3 0 top
C5  39.2,58.1 0 top
C6  36.6,51.95 0 top
C7  53.6,20.65 180 top
C8  53.6,15.15 180 top
C9  66.8,15.15 0 top
C10  66.8,20.65 0 top
C11  89.3,55.55 180 top
C12  89.3,50.05 180 top
C13  102.9,50.05 0 top
C14  102.9,55.55 0 top
C15  87.4,17.1 180 top
C16  104.2,16.3 0 top
C17  25,14.35 180 top
C18  25,8.85 180 top
C19  38.2,14.35 0 top
C20  38.2,8.85 0 top
C21  58.35,52.25 0 top
C22  58.35,44.25 0 top
DL1  52.4,50.3 0 top
DL2  52.4,42.3 0 top
IC1  34.9,58.1 0 top
IC2  30.7,50 0 top
JP1  43.2,4.13 0 top
N20  105,38.2 270 top
N21  62.4,38.2 270 top
N22  45.3,26.9 270 top
N23  28.7,26.9 270 top
R1  106.4,19.5 180 top
SJ1  22,4.13 0 top
U1  60.2,17.9 0 top
U2  96.1,52.8 0 top
U3  95.8,16.3 270 top
U4  31.6,11.6 0 top
U5  60.1,6.3 270 top
U$1  0,0 0 top
U$2  [SINGLE]  0,0 0 top
VR1  66.8,55.8 0 top

### Tracks (layer width: path | path; a pad name or v marks a point on that pad's centre or on a via)
!MEM-DONE  (via drill 0.3)
  Top 0.15: DL2.8 v54,40.35 | v29.3,50.7 27.93,50.7 IC2.3 | v35.8,46.8 v38.8,46.8
  Bottom 0.15: v38.8,46.8 41.4,44.2 49.8,44.2 50.15,44.2 v54,40.35 | v35.8,46.8 31.9,50.7 v29.3,50.7
!POWER-OK  (via drill 0.3, 0.3 pad 0.3)
  Top 0.15: U3.8 91.1,21.1 92.2,20 92.2,14 v91.6,13.4 | v70,5.35 U5.2
  Bottom 0.15: v91.6,13.4 83.31,5.11 v70,5.35
!STROBE
  Top 0.15: DL1.8 54.52,48.35 53.82,47.65 44.7,47.65 39.57,52.78 32,52.78 31.17,51.95 IC2.1
!WRITE-ENABLE  (via drill 0.3)
  Top 0.15: IC2.6 26.98,48.7 26.3,48.02 v26.3,36.6 | v59.1,10.3 66.91,10.3 68.61,12 87.4,12 87.7,12.3 U3.19
  Bottom 0.15: v59.1,10.3 34.9,10.3 33.17,8.57 32.42,8.57 26.3,14.69 v26.3,36.6
+5-BACKPLANE  (via drill 0.3 pad 0.3)
  Top 0.3: v15.1,4.13 SJ1.1
  Bottom 0.3: U$1.A2 v15.1,4.13
+5V  (via drill 0.3)
  Top 0.3: 31.55,11.45 28.95,8.85 U4.18 C18.1 | 31.55,11.45 34.15,8.85 U4.31 C20.1 | 31.55,11.45 31.55,14.4 | v31.6,19.9 31.6,14.45 31.55,14.4 | 31.5,14.35 U4.7 C17.1 | 31.5,14.35 31.55,14.4 | 31.5,14.35 U4.42 C19.1 | 31.55,11.45 31.55,7.08 | 31.55,7.08 28.6,4.13 SJ1.2 | 31.55,7.08 34.5,4.13 JP1.1 41.93,4.33 43.95,6.3 U5.3 C4.1 | v48.5,58.1 56,58.1 | 56,58.1 VR1.1 | C2.1 58.3,55.8 56,58.1
  Bottom 0.3: v31.6,19.9 37.4,25.7 37.4,47 v48.5,58.1
GND  (via drill 0.3, 0.3 pad 0.3)
  Top 0.3: U2.10 v91,54.05 | v93.8,51.55 U2.15 | U2.39 v98.3,54.05 | v101.8,51.55 U2.34 | v29.3,48.05 IC2.7 | v65.4,55.8 VR1.2 C2.2 | v50.8,48.35 DL1.7 | v50.8,40.35 DL2.7 | U4.45 v33.8,15.85 | U4.34 v33.8,10.35 | v29.3,10.35 U4.15 | v29.3,12.85 U4.10 | v32.5,58.1 IC1.2 | U4.39 v33.8,12.85 | U1.10 57.85,19.15 v57.9,19.2 | v65.9,16.65 U1.34 | U1.45 62.45,22.15 v62.4,22.2 | v74.4,59.9 C3.2 | U3.42 v102.5,17.1 | C1.2 v112.4,12.3 | U1.21 55.25,13.65 v54.6,13 | U3.14 v89.1,16.3 | v35.5,27.9 | v35.5,27.9 N23.3 | v35.5,34.9 N23.17 | N22.12 v46.6,32.4 | v52,34.9 N22.17 | v52,27.6 51.7,27.9 N22.3 | N21.17 v69.2,46.2 | N21.3 v69.2,39.2 | v69.2,39.2 | N20.3 v111.8,39.2 | v111.8,39.2 | U5.1 v57.8,7.25 | N20.10 v106.4,42.7 | N20.8 | v109.1,41.7 N20.8 | N20.6 v106.4,40.7 | U4.21 v26.2,7.35 | U4.24 v26.2,5.85 | U4.27 v33.9,6.85 | U3.52 v100.1,25.1 | U3.51 v99.4,24.3 | U3.47 v100.1,21.1 | v29.25,17.35 U4.1 | v29.25,15.85 U4.4 | R1.1 v109.4,19.5 | U3.50 v102.5,23.5 | U3.48 v102.5,21.9 | IC2.9 v34.9,48.7 | IC2.11 v34.9,50 | IC2.13 v34.9,51.3 | U1.4 v57.9,22.15 | U1.1 v57.9,23.65 | U1.24 55.67,12.15 54.92,11.4 v54.6,11.4 | U1.30 63.15,14.65 v62.3,13.8 | U1.29 65.55,14.15 v65.9,13.8 | U1.28 62.95,13.65 v62.3,13 | U1.27 65.55,13.15 v65.9,12.8 | U1.26 62.75,12.65 v62.3,12.2 | U2.21 v93.8,48.55 | U2.24 91.65,47.05 v91.1,46.5 | U4.29 v33.9,7.85 | N21.12 v63.8,43.7 | N21.8 v63.8,41.7 | N21.6 v63.8,40.7 | N21.14 v63.8,44.7 | v23.2,14.35 C17.2 | v23.2,8.85 C18.2 | v40,14.35 C19.2 | U4.26 36.4,6.35 v37,5.7 | U4.30 36.35,8.35 v37,7.7 | U4.28 36.4,7.35 v37,6.7 | v40,8.85 C20.2 | v51.8,20.65 C7.2 | v51.8,15.15 C8.2 | U1.15 54.65,16.65 v54.6,16.7 | C10.2 v68.6,20.65 | U1.39 65.65,19.15 v65.9,18.9 | C9.2 v68.6,15.15 | C15.2 v85.6,17.1 | C16.2 v106,16.3 | C11.2 v87.5,55.55
  Top 0.3: v93.8,57.1 93.75,57.05 U2.4 | C14.2 v104.7,55.55 | v98.3,57.05 U2.45 | N23.6 30.86,29.4 v30.13,28.67 | N23.8 31.37,30.37 30.1,30.37 v29.9,30.17 | N23.10 29.5,31.4 v29.2,31.1 | N23.12 28.96,32.4 v28.48,31.92 | N23.14 28.3,33.4 v27.7,32.8 | U2.1 v93.8,58.55 | N20.17 109.74,46.2 v109.07,45.53 | N20.14 v106.4,44.7 | N20.12 v109.1,43.7 | C13.2 v104.7,50.05 | C12.2 v87.5,50.05 | v98.3,48.1 98.75,48.55 U2.28 | U2.26 98.85,47.55 v98.3,47 | N22.14 v49.3,33.4 | N22.10 v49.3,31.4 | N22.8 v46.6,30.4 | v46.6,30.4 | N22.6 v49.3,29.4 | C6.2 v38.4,51.95 | VR1.4 v68.6,55.8 | C5.2 v41,58.1 | C22.2 v60.15,44.25 | C21.2 v60.15,52.25 | v63.8,42.7 N21.10 | C4.2 v66.1,6.3
  Bottom 0.3: U$1.U2 v15.1,54.93 | U$1.R2 v15.1,45.4 | v15.1,39 7.99,39 U$1.N2 | U$1.L2 v15.1,32.7 | U$1.J2 v15.1,26.35 | U$1.F2 v15.1,20 | U$1.C2 v15.1,10.48
  pour Layer2 (no thermals): 0,0 0,62.23 125.83,62.23 125.83,0
LATCH-MA  (via drill 0.3, 0.3 pad 0.3)
  Top 0.15: DL1.4 v50.8,50.3 | U2.48 v98.3,58.55 | U2.25 101.05,47.05 v101.2,47.2
  Bottom 0.15: v50.8,50.3 59.65,59.15 97.7,59.15 v98.3,58.55 101.2,55.65 v101.2,47.2
LATCH-MB  (via drill 0.3)
  Top 0.15: U1.48 v65.3,23.65 65.3,27.64 51.87,41.07 51.29,41.65 50.7,41.65 DL2.5 | U1.25 v65.3,12.15
  Layer3 0.15: v65.3,23.65 v65.3,12.15
LATCH-MEM  (via drill 0.3)
  Top 0.15: U4.25 34,5.85 32.8,7.05 v32.8,9.2 | DL1.9 55.89,49 56.26,48.62 56.26,48.08 55.47,47.28 44.64,47.28 38.9,41.54 38.9,20.05 36.2,17.35 U4.48 33.85,17.35 32.8,16.3 v32.8,15.2
  Bottom 0.15: v32.8,9.2 v32.8,15.2
MCS-MEM-00-H  (via drill 0.3)
  Top 0.15: N23.5 v32.7,28.9 | v27.1,24.8 22.2,19.9 22.2,17.8 23.15,16.85 U4.2
  Bottom 0.15: v32.7,28.9 31.2,28.9 v27.1,24.8
MCS-MEM-01-H  (via drill 0.3)
  Top 0.15: N23.7 v32.7,29.9 | v27.1,26.5 21.7,21.1 21.7,17.5 22.85,16.35 U4.3
  Bottom 0.15: v27.1,26.5 30.5,29.9 v32.7,29.9
MCS-MEM-02-H  (via drill 0.3)
  Top 0.15: N23.9 v32.7,30.9 | v27.1,28.2 21.2,22.3 21.2,17.2 23.05,15.35 U4.5
  Bottom 0.15: v32.7,30.9 29.8,30.9 v27.1,28.2
MCS-MEM-03-H  (via drill 0.3)
  Top 0.15: N23.11 v32.7,31.9 | v32.7,31.9 | v27.1,29.8 20.7,23.4 20.7,16.9 22.55,15.05 26.83,15.05 27.03,14.85 U4.6
  Bottom 0.15: v27.1,29.8 29.2,31.9 v32.7,31.9
MCS-MEM-04-H  (via drill 0.3)
  Top 0.15: N23.13 v32.7,32.9 | v32.7,32.9 | v27.1,31.4 20.2,24.5 20.2,16.6 23.25,13.55 26.73,13.55 27.03,13.85 U4.8
  Bottom 0.15: v32.7,32.9 28.6,32.9 v27.1,31.4
MCS-MEM-05-H  (via drill 0.3)
  Top 0.15: U4.9 27.03,13.35 26.63,12.95 23.05,12.95 19.7,16.3 19.7,26.1 v27.1,33.5 | N23.15 v32.7,33.9
  Bottom 0.15: v27.1,33.5 27.5,33.9 v32.7,33.9
MCS-MEM-06-H
  Top 0.15: N23.16 27.2,34.4 19.2,26.4 19.2,16 22.85,12.35 U4.11
MCS-MEM-07-H
  Top 0.15: U4.12 22.55,11.85 18.7,15.7 18.7,26.8 27.3,35.4 N23.18
MCS-MEM-08-H  (via drill 0.3)
  Top 0.15: U4.13 27.05,11.35 27.04,11.36 21.44,11.36 v20.6,12.2
  Bottom 0.15: U$1.D2 16.55,13.65 18,12.2 v20.6,12.2
MCS-MEM-09-H  (via drill 0.3)
  Top 0.15: U4.14 21.4,10.85 21.08,10.85 v15.1,16.83
  Bottom 0.15: U$1.E2 v15.1,16.83
MCS-MEM-10-H  (via drill 0.3)
  Top 0.15: v21.7,11.9 18.2,15.4 18.2,20.08 v15.1,23.18 | U4.16 27.05,9.85 26.7,10.2 v22.1,10.2
  Bottom 0.15: U$1.H2 v15.1,23.18 | v22.1,10.2 21.7,10.6 v21.7,11.9
MCS-MEM-11-H  (via drill 0.3)
  Top 0.15: v17.6,13.5 21.45,9.65 26.73,9.65 27.03,9.35 U4.17
  Bottom 0.15: U$1.K2 8.94,28.52 14.51,28.52 17.6,25.43 v17.6,13.5
MCT-MEM-DONE-L  (via drill 0.3)
  Top 0.15: v15.1,48.58 16.5,50 IC2.4
  Bottom 0.15: U$1.S2 v15.1,48.58
MCT-STROBE-L  (via drill 0.3)
  Top 0.15: v25.4,51.3 IC2.2
  Bottom 0.15: U$1.P2 16.33,42.23 v25.4,51.3
MXB-BMA-00-H
  Top 0.15: U2.47 104.85,58.05 112.8,50.1 112.8,43.8 111.2,42.2 N20.9
MXB-BMA-01-H
  Top 0.15: U2.46 104.75,57.55 112.4,49.9 112.4,44.4 111.2,43.2 N20.11
MXB-BMA-02-H
  Top 0.15: U2.44 100.67,56.55 100.87,56.75 104.95,56.75 112,49.7 112,45 111.2,44.2 N20.13
MXB-BMA-03-H
  Top 0.15: U2.43 100.67,56.05 100.87,56.25 104.85,56.25 111.6,49.5 111.6,45.6 111.2,45.2 N20.15
MXB-BMA-04-H
  Top 0.15: U2.41 101.17,55.05 101.36,54.86 102.24,54.86 108.9,48.2 108.9,46.1 108.5,45.7 N20.16
MXB-BMA-05-H
  Top 0.15: U2.40 101.45,54.55 106.5,49.5 106.5,47.1 106.9,46.7 N20.18
MXB-BMA-06-H  (via drill 0.3)
  Top 0.15: U2.38 99.66,53.55 98.75,53.55 97.6,52.4 v94.6,52.4 | N21.4 v63.8,39.7
  Bottom 0.15: v94.6,52.4 94.4,52.6 93.4,52.6 92.6,53.4 81.98,53.4 73.69,45.11 69.11,45.11 v63.8,39.7
MXB-BMA-07-H  (via drill 0.3)
  Top 0.15: v95.7,51.7 96.1,52.09 97.73,52.09 98.68,53.05 U2.37 | v83,52.2 71,40.2 N21.5
  Bottom 0.15: v95.7,51.7 94.5,51.7 94,52.2 v83,52.2
MXB-BMA-08-H  (via drill 0.3)
  Top 0.15: U2.36 98.61,52.55 97.85,51.79 96.79,51.79 v95.7,50.7 | v81.4,51.6 71,41.2 N21.7
  Bottom 0.15: v95.7,50.7 93.7,50.7 92.8,51.6 v81.4,51.6
MXB-BMA-09-H  (via drill 0.3)
  Top 0.15: v82.4,42.2 90,42.2 97.2,49.4 97.2,50.71 98.54,52.05 U2.35 | N21.9 v70.4,42.2
  Bottom 0.15: v82.4,42.2 v70.4,42.2
MXB-BMA-10-H  (via drill 0.3)
  Top 0.15: v84.8,41.5 89.83,41.5 97.61,49.27 97.61,50.35 98.31,51.05 U2.33 | N21.11 v71.6,43.2 | v71.6,43.2
  Bottom 0.15: v84.8,41.5 83.1,43.2 v71.6,43.2
MXB-BMA-11-H  (via drill 0.3)
  Top 0.15: v105.3,45.3 105.3,50.2 104.75,50.75 100.87,50.75 100.67,50.55 U2.32 | v69.2,44.2 N21.13 | N21.13
  Layer3 0.15: v105.3,45.3 104.2,44.2 86.9,44.2 v84.8,44.2
  Bottom 0.15: v84.8,44.2 v69.2,44.2
MXB-MCBMB-00-H  (via drill 0.3)
  Top 0.15: N21.15 66.8,45.2 66.4,44.8 v66.4,34.6 | U1.47 65.06,23.15 65.08,23.12 65.52,23.12 66.4,24.01 v66.4,31.1
  Bottom 0.15: v66.4,34.6 v66.4,31.1
MXB-MCBMB-01-H
  Top 0.15: U1.46 65.57,22.65 68.6,25.68 68.6,31.3 62.4,37.5 62.4,44.4 63.7,45.7 N21.16
MXB-MCBMB-02-H  (via drill 0.3)
  Top 0.15: N21.18 63.6,46.7 61.7,44.8 61.7,37.2 v68,30.9 | v69.2,31 69.2,25.75 65.1,21.65 U1.44
  Bottom 0.15: v68,30.9 68.1,31 v69.2,31
MXB-MCBMB-03-H
  Top 0.15: U1.43 65.17,21.15 75.02,31 92.6,31 101.3,39.7 N20.4
MXB-MCBMB-04-H
  Top 0.15: U1.41 64.83,20.15 65.01,19.98 68.87,19.98 69.83,20.93 69.83,25.02 74.8,30 105.8,30 113,37.2 113,39.5 112.3,40.2 N20.5
MXB-MCBMB-05-H
  Top 0.15: N20.7 112.5,41.2 114,39.7 114,36.8 106.2,29 74.56,29 70.33,24.77 70.33,20.63 69.24,19.55 64.87,19.55 64.77,19.65 U1.40
MXB-MCBMB-06-H  (via drill 0.3)
  Top 0.15: v57.6,30.9 N22.9 | U1.38 62.95,18.65 v60,21.6
  Bottom 0.15: v57.6,30.9 57.6,24.9 60,22.5 v60,21.6
MXB-MCBMB-07-H  (via drill 0.3)
  Top 0.15: U1.37 62.45,18.15 v59,21.6 | v56.6,31.9 | v56.6,31.9 N22.11
  Bottom 0.15: v59,21.6 59,21.8 56.6,24.2 v56.6,31.9
MXB-MCBMB-08-H  (via drill 0.3)
  Top 0.15: v60.2,19.2 60.9,19.2 62.45,17.65 U1.36 | N22.13 | v55.6,32.9 N22.13
  Bottom 0.15: v60.2,19.2 58.9,19.2 58.2,19.9 57.74,19.9 55.6,22.04 v55.6,32.9
MXB-MCBMB-09-H  (via drill 0.3)
  Top 0.15: U1.35 v61.8,17.15 | v54.6,33.9 N22.15
  Bottom 0.15: v54.6,33.9 54.6,21.7 58.57,17.73 60.3,17.73 61.22,17.73 v61.8,17.15
MXB-MCBMB-10-H  (via drill 0.3)
  Top 0.15: v60.5,16.7 61.1,16.7 61.65,16.15 U1.33 | N22.16 46.8,34.4 45.97,33.57 45.97,28.33 v46.6,27.7
  Bottom 0.15: v60.5,16.7 58.43,16.7 58.24,16.52 57.78,16.52 v46.6,27.7
MXB-MCBMB-11-H  (via drill 0.3)
  Top 0.15: v60.6,15.4 61.6,15.4 61.85,15.65 U1.32 | v46.6,26.7 45.26,28.04 45.26,33.86 46.8,35.4 N22.18
  Bottom 0.15: v60.6,15.4 57.9,15.4 v46.6,26.7
MXB-MEM-TP3-H  (via drill 0.3)
  Top 0.15: IC1.3 26.95,57.15 v26.5,57.6
  Bottom 0.15: v26.5,57.6 26,58.1 U$1.V2
MXB-START-MEMORY-H  (via drill 0.3)
  Top 0.15: IC1.1 33.73,59.1 v32.5,59.1
  Bottom 0.15: U$1.M2 14.67,35.88 26.04,47.26 26.04,52.64 v32.5,59.1
MXF-EA-00-H  (via drill 0.3)
  Top 0.15: U2.30 98.69,49.55 98.56,49.42 98.26,49.42 88.14,39.3 84.7,39.3 v81.2,35.8 | v49.3,28.4 N22.4 | v59.4,28.3 58.7,27.6 v53.1,27.6
  Bottom 0.15: v81.2,35.8 79.6,34.2 75.7,34.2 71.8,30.3 61.43,30.3 59.43,28.3 v59.4,28.3 | v49.3,28.4 52.3,28.4 v53.1,27.6
MXF-EA-01-H  (via drill 0.3)
  Top 0.15: v81.2,34.3 85.89,38.99 88.35,38.99 98.41,49.05 U2.29 | N22.5 61.9,28.9 v62.6,29.6
  Bottom 0.15: v62.6,29.6 72.17,29.6 76.07,33.51 80.41,33.51 v81.2,34.3
MXF-EA-02-H  (via drill 0.3)
  Top 0.15: v81.2,32.8 92.21,32.8 101.91,42.5 101.91,47.3 101.16,48.05 U2.27 | N22.7 61.3,29.9 v61.6,29.6
  Bottom 0.15: v81.2,32.8 76.4,32.8 72.5,28.9 62.3,28.9 v61.6,29.6
N$2  (via drill 0.3)
  Top 0.15: U4.47 47.4,16.85 48.2,17.65 U1.13 57.44,17.65 58.12,18.3 v59,18.3 | U3.9 89.59,20.3 89.25,19.95 87.3,19.95 86.64,19.3 82.5,19.3 81.5,18.3 v67.9,18.3
  Bottom 0.15: v67.9,18.3 v59,18.3
N$3  (via drill 0.3)
  Top 0.15: U4.46 47.7,16.35 48.6,17.25 55.13,17.25 55.23,17.15 U1.14 57.95,17.15 v58,17.1 | v66.9,17.4 81.3,17.4 82.7,18.8 86.8,18.8 87.5,19.5 U3.10
  Bottom 0.15: v66.9,17.4 64.16,17.4 63.34,16.58 61.49,16.58 60.75,17.31 58.19,17.31 58,17.12 v58,17.1
N$4  (via drill 0.3)
  Top 0.15: U4.44 49.4,15.35 50.2,16.15 U1.16 57.95,16.15 58.1,16 v59.8,16 | v66.9,16.3 79.3,16.3 81,16.3 83.01,18.3 87,18.3 87.39,18.7 U3.11
  Bottom 0.15: v66.9,16.3 66.4,16.3 66.1,16 v59.8,16
N$5  (via drill 0.3)
  Top 0.15: U4.43 36.17,14.85 36.37,15.05 49.58,15.05 50.41,15.85 55.41,15.85 55.61,15.65 U1.17 58.84,15.65 v60.1,14.39 | v66.9,14.1 79.6,14.1 83.4,17.9 U3.12
  Bottom 0.15: v60.1,14.39 66.61,14.39 v66.9,14.1
N$6
  Top 0.15: U3.15 88.5,15.5 86.2,13.2 67.74,13.2 66.04,11.5 61.05,11.5 57.9,14.65 U1.19 54.93,14.65 53.93,13.65 36.37,13.65 36.17,13.85 U4.41
N$7
  Top 0.15: U4.40 54.15,13.35 54.95,14.15 U1.20 57.68,14.15 60.63,11.2 66.3,11.2 68,12.9 86.5,12.9 88.3,14.7 U3.16
N$9
  Top 0.15: U3.45 102.8,19.5 | U3.46 102,20.3 102.8,19.5 | U3.44 102,18.7 102.8,19.5 | U3.43 102,17.9 103.6,19.5
  Top 0.3: 102.8,19.5 103.6,19.5 R1.2
N$11
  Top 0.15: U4.38 54.83,12.35 55.63,13.15 U1.22 57.94,13.15 60.19,10.9 66.52,10.9 68.2,12.6 86.8,12.6 88.1,13.9 U3.17
N$13
  Top 0.15: U4.37 54.09,11.85 54.25,12.01 54.95,12.01 55.6,12.65 U1.23 57.74,12.65 59.79,10.6 66.73,10.6 68.43,12.3 87.1,12.3 87.9,13.1 U3.18
N$14  (via drill 0.3)
  Top 0.15: U3.37 v100.1,13.1 | v86.3,19.9 75.94,19.9 71.14,24.7 v71.1,24.7 | U4.36 v33.8,11.35 | v45.2,18.7 49.65,23.15 U1.2
  Layer3 0.15: v71.1,24.7 51.2,24.7 v45.2,18.7
  Bottom 0.15: v100.1,13.1 93.1,13.1 v86.3,19.9 | v45.2,18.7 45.2,12.38 44.18,11.35 v33.8,11.35
N$15  (via drill 0.3)
  Top 0.15: U1.3 50.19,22.65 v46.2,18.7 | v46.2,11.1 45.98,10.85 U4.35 | U3.38 v99.1,13.9 | v87.2,20.6 76.6,20.6 v73.3,23.9
  Layer3 0.15: v73.3,23.9 65.92,23.9 65.52,24.31 51.81,24.31 v46.2,18.7
  Bottom 0.15: v46.2,18.7 v46.2,11.1 | v87.2,20.6 90.87,16.93 90.87,16.84 93.81,13.9 v99.1,13.9
N$16  (via drill 0.3)
  Top 0.15: U4.33 36.17,9.85 36.47,10.15 46.35,10.15 v47.2,11.1 | U3.39 101.2,14.6 v100.1,14.6 | v88.5,20.6 87.69,21.41 77.19,21.41 v72.5,26.1 | v47.2,18.7 50.15,21.65 U1.5
  Layer2 0.15: v72.5,26.1 54.6,26.1 v47.2,18.7
  Bottom 0.15: v47.2,18.7 v47.2,11.1 | v100.1,14.6 94.52,14.6 92.13,16.98 92.13,17.36 91.76,17.73 91.37,17.73 v88.5,20.6
N$17  (via drill 0.3)
  Top 0.15: U1.6 55.63,21.15 55.43,21.35 50.83,21.35 48.2,18.72 v48.2,18.7 | v48.2,11.1 46.68,9.55 36.37,9.55 36.17,9.35 U4.32 | U3.40 v99.1,15.5 | v88.5,21.9 78.2,21.9 v74.7,25.4
  Layer2 0.15: v74.7,25.4 54.9,25.4 v48.2,18.7
  Bottom 0.15: v48.2,18.7 v48.2,11.1 | v99.1,15.5 94.9,15.5 v88.5,21.9
N$30  (via drill 0.3)
  Top 0.15: v76.3,31.7 76.3,43.8 83.65,51.15 83.65,55.35 86.35,58.05 U2.2 | v76.3,11.3 78.5,9.1 U3.23
  Bottom 0.15: v76.3,31.7 v76.3,11.3
N$31  (via drill 0.3)
  Top 0.15: v89.1,23.5 U3.5 | v86.5,50.05 88.1,51.65 90.93,51.65 91.53,51.05 U2.16
  Bottom 0.15: v89.1,23.5 86.59,26.01 86.51,26.09 v86.5,50.05
N$32  (via drill 0.3)
  Top 0.15: U2.13 93.65,52.55 94.53,51.67 94.53,47.83 v91.6,44.9 | v91.6,26.7 91.6,25.7 91,25.1 U3.3
  Bottom 0.15: v91.6,44.9 v91.6,26.7
N$33  (via drill 0.3)
  Top 0.15: U2.14 91.53,52.05 90.93,52.65 88.1,52.65 v85.5,50.05 | U3.4 87.5,24.3 v85.5,26.3
  Bottom 0.15: v85.5,50.05 v85.5,26.3
N$34  (via drill 0.3)
  Top 0.15: v91.8,23.6 91.8,23.3 91.2,22.7 U3.6 | v90,51 90.7,51 91.15,50.55 U2.17
  Bottom 0.15: v91.8,23.6 91.8,23.8 89.5,26.1 89.5,50.5 v90,51
N$36  (via drill 0.3)
  Top 0.15: v90.5,49.1 90.95,49.55 U2.19 | v92.9,23.6 92.9,23 91.8,21.9 U3.7
  Bottom 0.15: v90.5,49.1 90.5,26.2 92.9,23.8 v92.9,23.6
N$37  (via drill 0.3)
  Top 0.15: U3.20 89.2,11.5 89,11.3 v80.3,11.3 | v80.3,31.7 80.3,43.3 v81.9,44.9 | v83.7,46.7 88.9,46.7 90.75,48.55 91.03,48.55 91.53,49.05 U2.20
  Bottom 0.15: v80.3,11.3 v80.3,31.7 | v81.9,44.9 v83.7,46.7
N$38  (via drill 0.3)
  Top 0.15: U3.21 90.2,10.6 80,10.6 v79.3,11.3 | v81.9,46.1 89.1,46.1 91.06,48.06 U2.22 | v79.3,31.7 79.3,43.5 v80.7,44.9
  Bottom 0.15: v79.3,11.3 v79.3,31.7 | v81.9,46.1 v80.7,44.9
N$39  (via drill 0.3)
  Top 0.15: U3.22 79.7,9.9 v78.3,11.3 | v78.3,31.7 78.3,43.5 80.35,45.55 89.33,45.55 91.33,47.55 U2.23
  Bottom 0.15: v78.3,11.3 v78.3,31.7
N$40  (via drill 0.3)
  Top 0.15: U3.24 78.3,8.3 v77.3,9.3 | v77.3,31.7 77.3,43.67 84.27,50.63 84.27,55.17 86.65,57.55 U2.3
  Bottom 0.15: v77.3,9.3 v77.3,31.7
N$41  (via drill 0.3)
  Top 0.15: U2.5 97.15,56.55 v97.5,56.2 | v104.8,8.3 U3.31
  Bottom 0.15: v97.5,56.2 97.67,56.03 97.67,46.69 108.8,35.56 108.8,12.3 v104.8,8.3
N$42  (via drill 0.3)
  Top 0.15: U3.32 v104.2,9.1 | U2.6 93.38,56.05 93.51,56.18 96.12,56.18 v96.8,55.5
  Bottom 0.15: v96.8,55.5 97.36,54.94 97.36,46.2 107.7,35.86 107.7,12.6 v104.2,9.1
N$43  (via drill 0.3)
  Top 0.15: v95.7,54.55 95.34,54.95 93.43,54.95 93.33,55.05 U2.8 | v103.6,9.9 U3.33
  Bottom 0.15: v95.7,54.55 97.06,53.24 97.06,45.67 106.6,36.13 106.6,12.9 v103.6,9.9
N$44  (via drill 0.3)
  Top 0.15: v103,10.7 U3.34 | v94.7,54.2 94.35,54.55 U2.9
  Bottom 0.15: v103,10.7 105.4,13.1 105.4,36.5 96.75,45.15 96.75,52.2 v94.7,54.2
N$45  (via drill 0.3)
  Top 0.15: U3.35 v102.4,11.5 | U2.11 93.55,53.55 v93.9,53.2
  Bottom 0.15: v102.4,11.5 104.3,13.4 104.3,36.8 96.45,44.65 96.45,51.85 95.16,53.15 v93.9,53.2
START-MEMORY
  Top 0.15: IC1.6 41.25,59.05 48.05,52.25 DL1.1
TIMING-PULSE-3  (via drill 0.3)
  Top 0.15: IC1.4 36.85,57.15 v44.7,49.3 | DL2.1 48.65,44.25 v46.4,46.5
  Bottom 0.15: v46.4,46.5 45.4,47.5 45.4,48.6 v44.7,49.3
VCAP
  Top 0.3: C1.1 U3.36
VCC  (via drill 0.3)
  Top 0.3: v54,52.25 DL1.14 C21.1 | VR1.3 v65.4,53.5 | v91.5,17.1 U3.13 C15.1 | v100.1,16.3 U3.41 C16.1 | v62.4,20.7 62.45,20.65 U1.42 C10.1 | v54,44.25 DL2.14 C22.1 | IC1.5 v37.4,58.1 C5.1 | C3.1 v74.4,51.7 | v93.8,55.55 U2.7 C11.1 | v93.8,50.05 U2.18 C12.1 | v57.9,20.65 U1.7 C7.1 | v98.3,50.05 U2.31 C13.1 | v58.8,14.85 58.5,15.15 U1.18 C8.1 | v62.5,15.05 62.6,15.15 U1.31 C9.1 | v98.3,55.55 U2.42 C14.1 | v32.1,51.95 IC2.14 C6.1
  pour Layer3 (no thermals): 0,0 125.8,0 125.8,62.3 0,62.3
WRITE-ENABLE  (via drill 0.3)
  Top 0.15: v54,41.65 DL2.10 56.35,41.65 61,37 61,32.8 v65.8,28 | v39.6,47.6 32.55,47.6 30.8,49.35 IC2.5 | v74.3,27.3 78.9,22.7 v87.2,22.7 | v100.1,22.7 U3.49
  Bottom 0.15: v39.6,47.6 42.2,45 49.1,45 50.65,45 v54,41.65 | v65.8,28 66.5,27.3 v74.3,27.3 | v87.2,22.7 v100.1,22.7

### Text on the board
Top: MM24I 24k Memory Expansion Mk I
Bottom: Designed by Julian Nowaczek, 2019-2022
tStop: MM24I 24k Memory Expansion Mk I
bStop: Designed by Julian Nowaczek, 2019-2022
tDocu: +5 | GND